# Altium project iMX6 Rex Development Baseboard V1I1.PrjPcb (part 1 of 2)
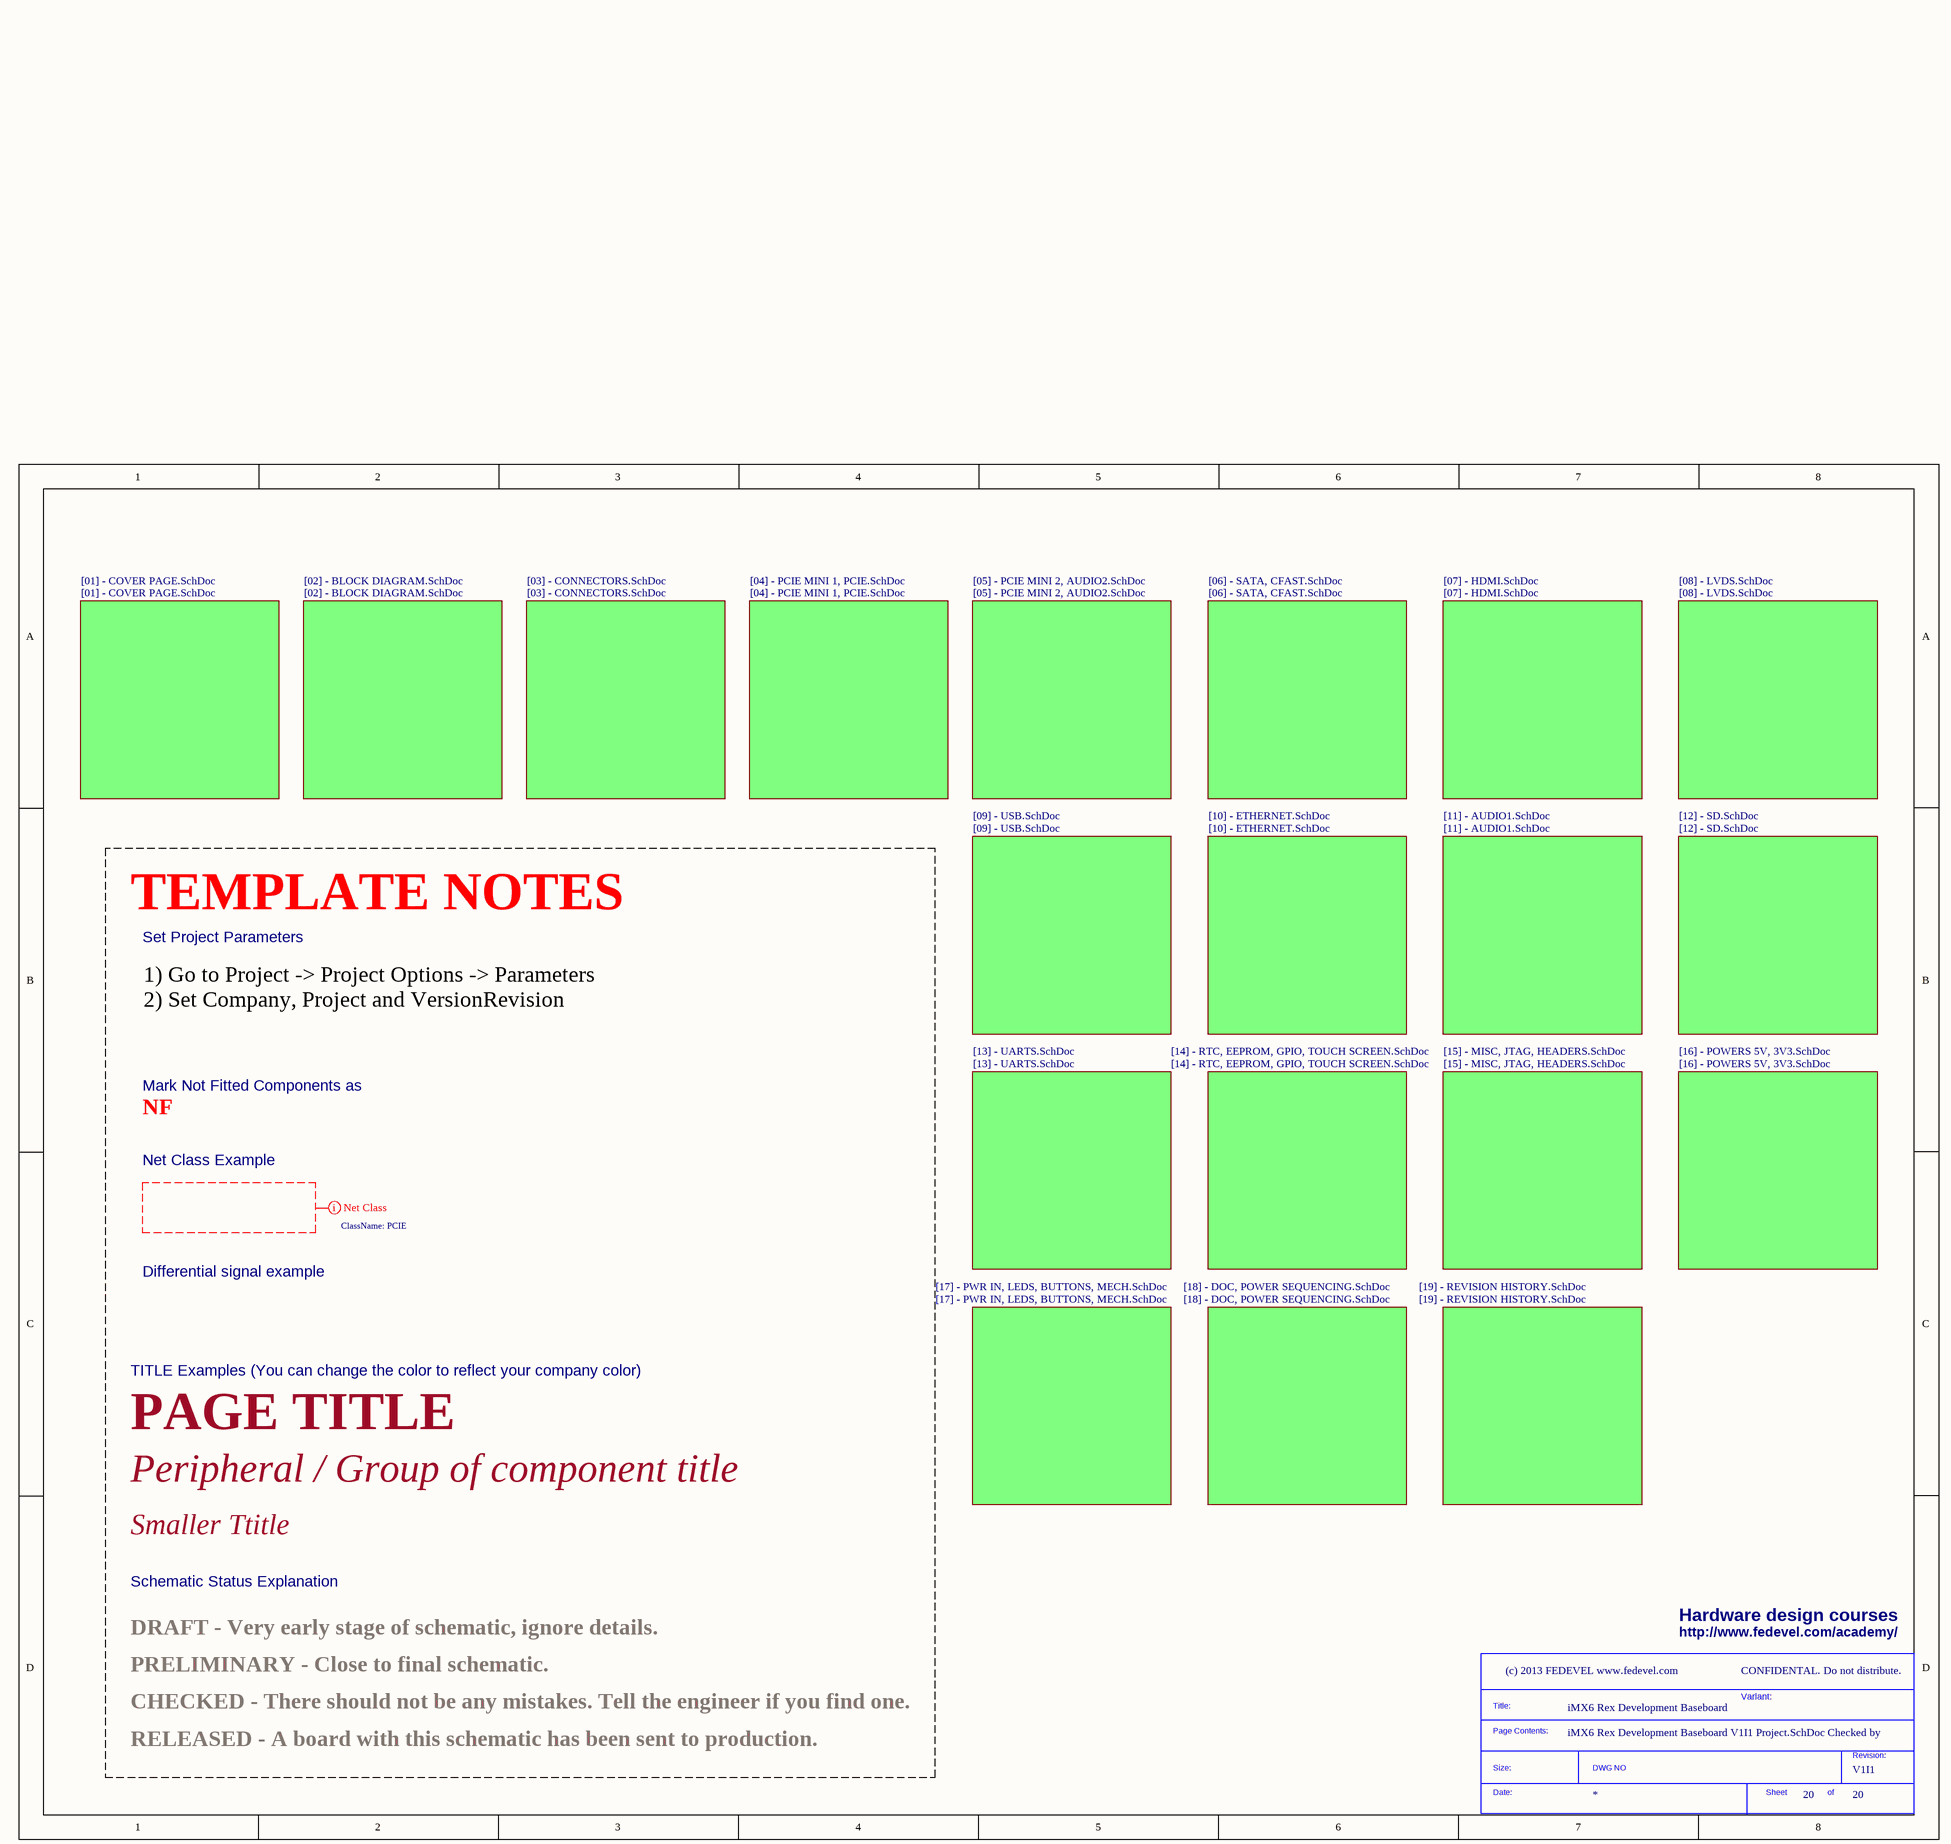
[diagram p0: iMX6 Rex Development Baseboard V1I1 Project.SchDoc]
ClientCompanyName: FEDEVEL Academy; ClientContactEmail: robert.feranec@fedevel.com; ClientContactName: Robert Feranec; ClientWebsite: http://www.fedevel.com/academy/; Company: (c) 2013 FEDEVEL www.fedevel.com; Project: iMX6 Rex Development Baseboard; VersionRevision: V1I1
5 sheets, 70 parts. Net scope: flat (ports and power ports of the same name join across sheets).
Board file: iMX6 Rex Development Baseboard V1I1_PCB.PcbDoc
Sheets:
  iMX6 Rex Development Baseboard V1I1 Project.SchDoc
    [03] - CONNECTORS.SchDoc = [03] - CONNECTORS.SchDoc
    [07] - HDMI.SchDoc = [07] - HDMI.SchDoc
    [15] - MISC, JTAG, HEADERS.SchDoc = [15] - MISC, JTAG, HEADERS.SchDoc
    [18] - DOC, POWER SEQUENCING.SchDoc = [18] - DOC, POWER SEQUENCING.SchDoc

## Sheet iMX6 Rex Development Baseboard V1I1 Project.SchDoc
size A3; CompanyName: FEDEVEL; Organization: FEDEVEL; DocumentNumber: 20; Revision: V1I1; SheetNumber: 20; SheetTotal: 20; PageSetup: Record=PageOptions|CenterHorizontal=True|CenterVertical=True|PrintScale=1.07|XCorrection=1.00|YCorrection=1.00|PrintKind=1|BorderSize=5000000|LeftOffset=0|BottomOffset=0|Orientation=2|PaperLength=1000|PaperWidth=1000|Scale=100|PaperSource=7|PrintQuality=600|MediaType=1|DitherType=10|PaperKind=A3|PrintScaleMode=1; ProjectName: KDS C6A816x Module

### Parts
(Parts that share a designator on the sheet are numbered #1, #2 ... from top to bottom, then left to right.)
*#1  SDTitleBlock  (value not drawn)  (graphical)

### Sub-sheets
[01] - COVER PAGE.SchDoc = [01] - COVER PAGE.SchDoc (file not in this document): no entries
[02] - BLOCK DIAGRAM.SchDoc = [02] - BLOCK DIAGRAM.SchDoc (file not in this document): no entries
[03] - CONNECTORS.SchDoc = [03] - CONNECTORS.SchDoc: no entries
[04] - PCIE MINI 1, PCIE.SchDoc = [04] - PCIE MINI 1, PCIE.SchDoc (file not in this document): no entries
[05] - PCIE MINI 2, AUDIO2.SchDoc = [05] - PCIE MINI 2, AUDIO2.SchDoc (file not in this document): no entries
[06] - SATA, CFAST.SchDoc = [06] - SATA, CFAST.SchDoc (file not in this document): no entries
[07] - HDMI.SchDoc = [07] - HDMI.SchDoc: no entries
[08] - LVDS.SchDoc = [08] - LVDS.SchDoc (file not in this document): no entries
[09] - USB.SchDoc = [09] - USB.SchDoc (file not in this document): no entries
[10] - ETHERNET.SchDoc = [10] - ETHERNET.SchDoc (file not in this document): no entries
[11] - AUDIO1.SchDoc = [11] - AUDIO1.SchDoc (file not in this document): no entries
[12] - SD.SchDoc = [12] - SD.SchDoc (file not in this document): no entries
[13] - UARTS.SchDoc = [13] - UARTS.SchDoc (file not in this document): no entries
[14] - RTC, EEPROM, GPIO, TOUCH SCREEN.SchDoc = [14] - RTC, EEPROM, GPIO, TOUCH SCREEN.SchDoc (file not in this document): no entries
[15] - MISC, JTAG, HEADERS.SchDoc = [15] - MISC, JTAG, HEADERS.SchDoc: no entries
[16] - POWERS 5V, 3V3.SchDoc = [16] - POWERS 5V, 3V3.SchDoc (file not in this document): no entries
[17] - PWR IN, LEDS, BUTTONS, MECH.SchDoc = [17] - PWR IN, LEDS, BUTTONS, MECH.SchDoc (file not in this document): no entries
[18] - DOC, POWER SEQUENCING.SchDoc = [18] - DOC, POWER SEQUENCING.SchDoc: no entries
[19] - REVISION HISTORY.SchDoc = [19] - REVISION HISTORY.SchDoc (file not in this document): no entries

### Layout directives
net class PCIE: (no net found under the mark)

### Notes on the sheet
- TEMPLATE NOTES
- Set Project Parameters
- 1) Go to Project -> Project Options -> Parameters
  2) Set Company, Project and VersionRevision
- NF
- Mark Not Fitted Components as
- Net Class Example
- Differential signal example
- TITLE Examples (You can change the color to reflect your company color)
- PAGE TITLE
- Peripheral / Group of component title
- Smaller Ttitle
- Schematic Status Explanation
- Hardware design courses
- PRELIMINARY - Close to final schematic.
- DRAFT - Very early stage of schematic, ignore details.
- http://www.fedevel.com/academy/
- CONFIDENTAL. Do not distribute.
- CHECKED - There should not be any mistakes. Tell the engineer if you find one.
- Variant:
- Checked by
- RELEASED - A board with this schematic has been sent to production.
- (in symbol SDTitleBlock) Title:; Page Contents:; Revision:; Size:; DWG NO; Date:; Sheet; of

## Sheet [03] - CONNECTORS.SchDoc
size A3; DocumentNumber: 2; SheetNumber: 3; SheetTotal: 19
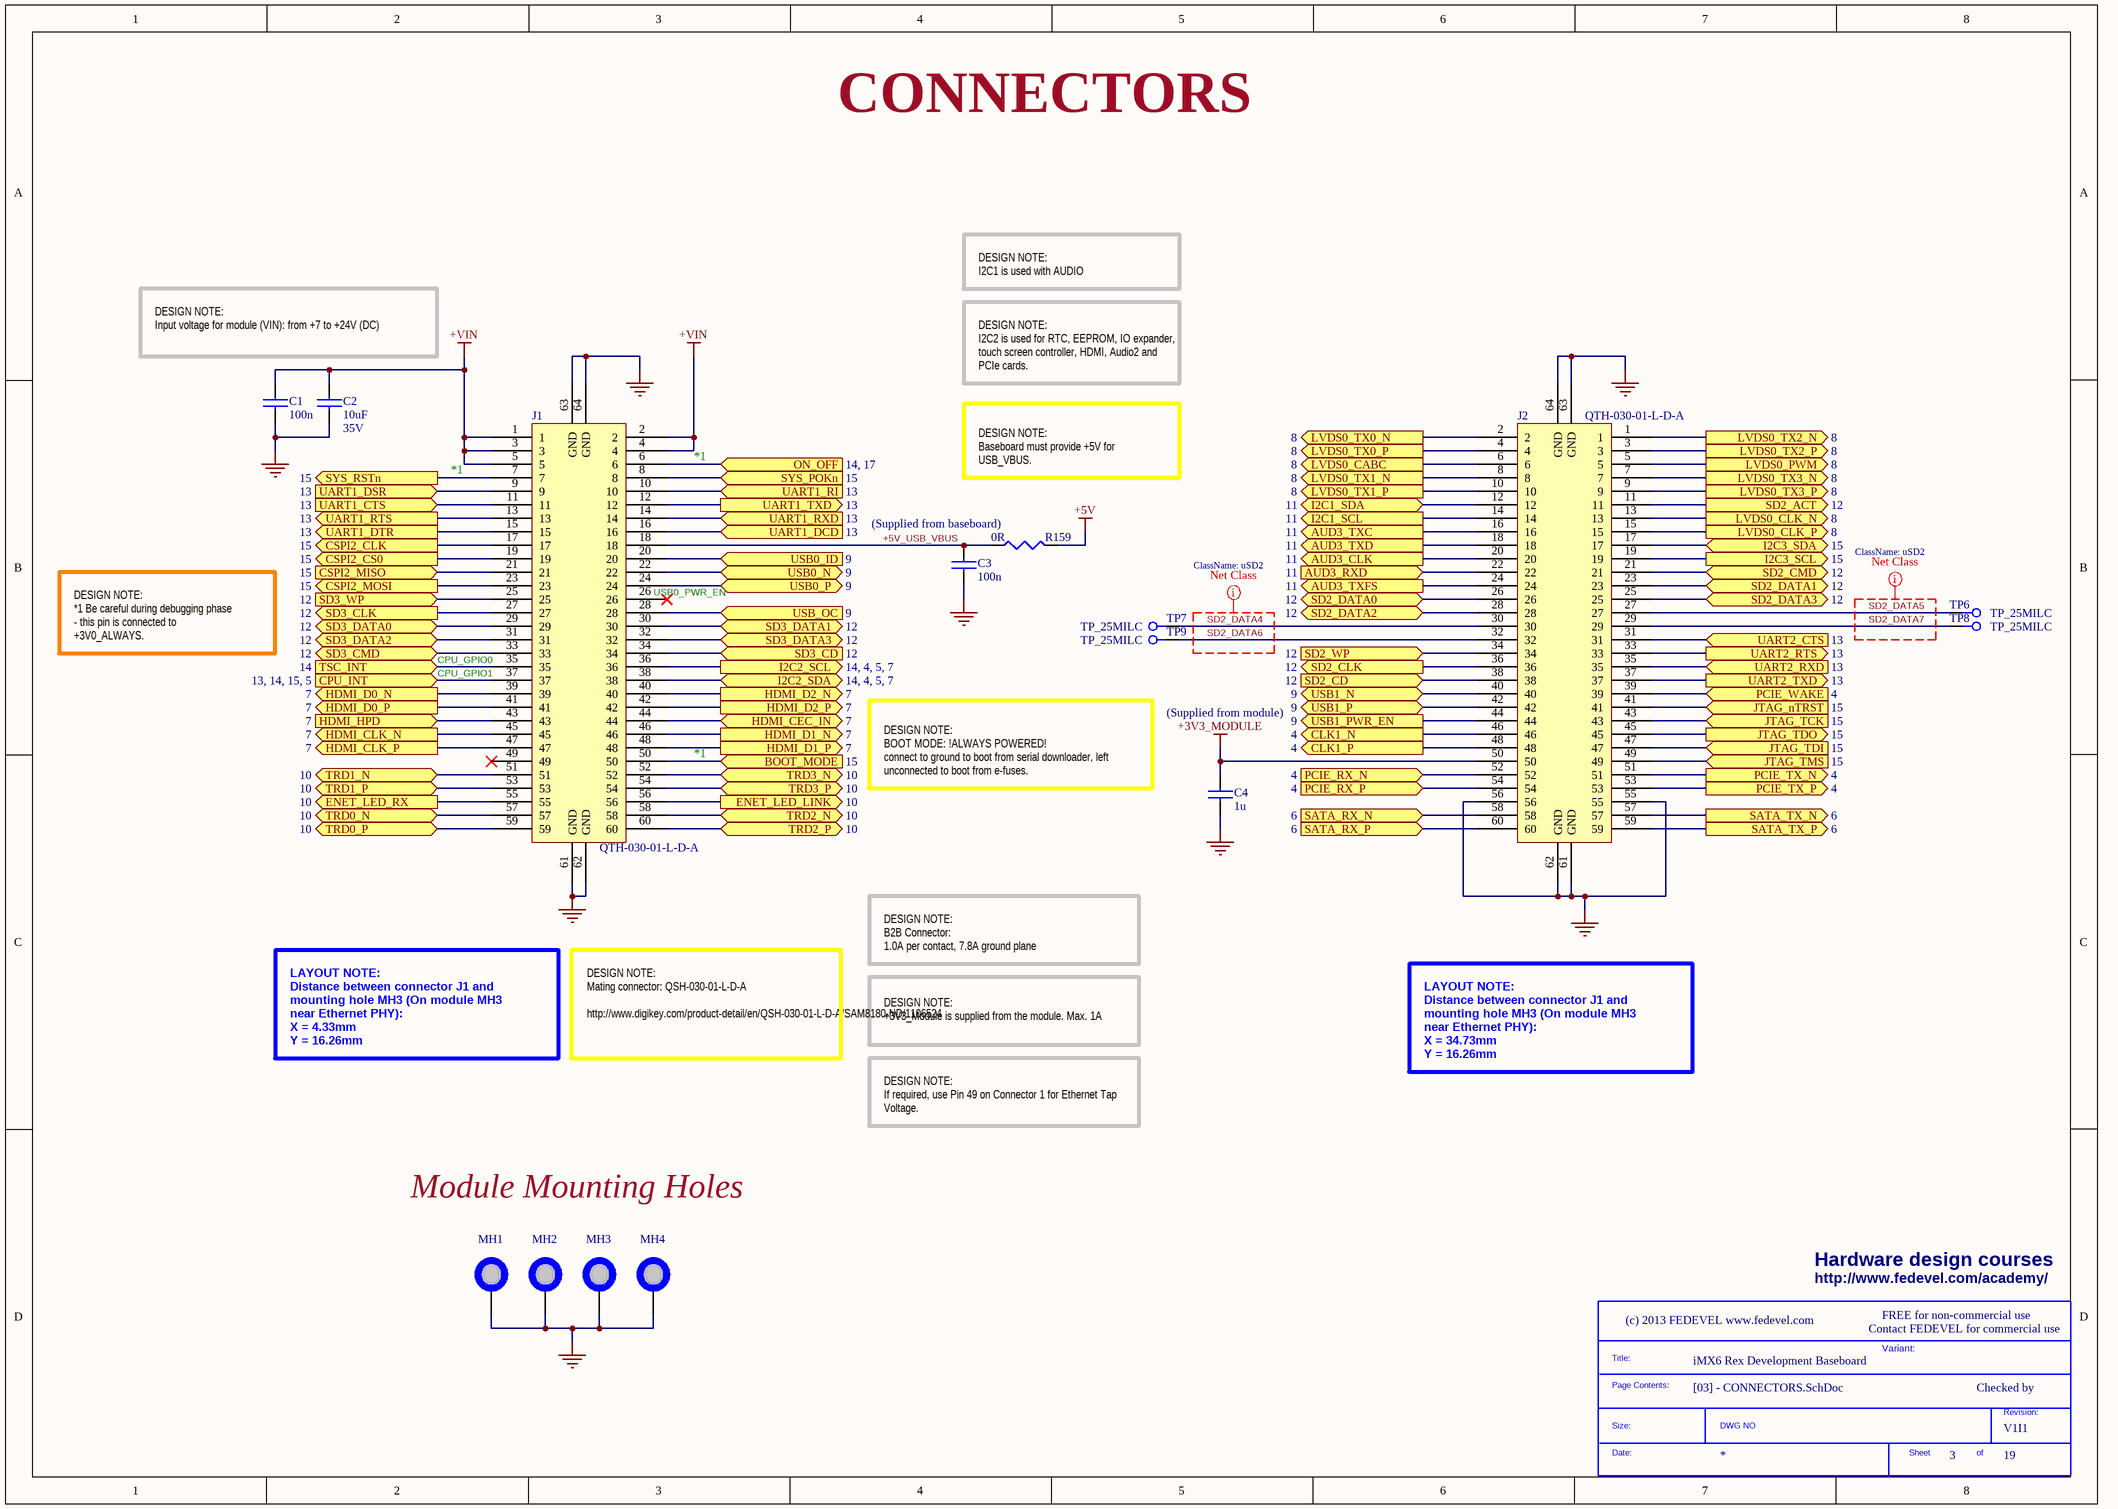
[diagram p1: [03] - CONNECTORS.SchDoc]

### Parts
(Parts that share a designator on the sheet are numbered #1, #2 ... from top to bottom, then left to right.)
*#2  SDTitleBlock  (value not drawn)  (graphical)
C1  100n  [C0402]
C2  10uF  Voltage - Rated: 35V  [C1206]
C3  100n  [C0402]
C4  1u  [C0402]
J1  QTH-030-01-L-D-A  [QTH-030-01-L-D-A]
J2  QTH-030-01-L-D-A  [QTH-030-01-L-D-A]
MH1  MH_5MMC_2.2MMD  [MH_5MMD_2.2MMD]  (value not drawn)  (no BOM)
MH2  MH_5MMC_2.2MMD  [MH_5MMD_2.2MMD]  (value not drawn)  (no BOM)
MH3  MH_5MMC_2.2MMD  [MH_5MMD_2.2MMD]  (value not drawn)  (no BOM)
MH4  MH_5MMC_2.2MMD  [MH_5MMD_2.2MMD]  (value not drawn)  (no BOM)
R159  0R  [R0402]
TP6  TP_25MILC  [TP_25C]  (no BOM)
TP7  TP_25MILC  [TP_25C]  (no BOM)
TP8  TP_25MILC  [TP_25C]  (no BOM)
TP9  TP_25MILC  [TP_25C]  (no BOM)

### Ports
AUD3_CLK (out, see 11), AUD3_RXD (in, see 11), AUD3_TXC (out, see 11), AUD3_TXD (out, see 11), AUD3_TXFS (out, see 11), BOOT_MODE (in, see 15), CLK1_N (out, see 4), CLK1_P (out, see 4), CPU_INT (in, see 13, 14, 15, 5), CSPI2_CLK (out, see 15), CSPI2_CS0 (out, see 15), CSPI2_MISO (in, see 15), CSPI2_MOSI (out, see 15), ENET_LED_LINK (out, see 10), ENET_LED_RX (out, see 10), HDMI_CEC_IN (bidir, see 7), HDMI_CLK_N (out, see 7), HDMI_CLK_P (out, see 7), HDMI_D0_N (out, see 7), HDMI_D0_P (out, see 7), HDMI_D1_N (out, see 7), HDMI_D1_P (out, see 7), HDMI_D2_N (out, see 7), HDMI_D2_P (out, see 7), HDMI_HPD (in, see 7), I2C1_SCL (out, see 11), I2C1_SDA (bidir, see 11), I2C2_SCL (see 14, 4, 5, 7), I2C2_SDA (bidir, see 14, 4, 5, 7), I2C3_SCL (out, see 15), I2C3_SDA (bidir, see 15), JTAG_nTRST (in, see 15), JTAG_TCK (in, see 15), JTAG_TDI (in, see 15), JTAG_TDO (out, see 15), JTAG_TMS (in, see 15), LVDS0_CABC (out, see 8), LVDS0_CLK_N (out, see 8), LVDS0_CLK_P (out, see 8), LVDS0_PWM (out, see 8), LVDS0_TX0_N (out, see 8), LVDS0_TX0_P (out, see 8), LVDS0_TX1_N (out, see 8), LVDS0_TX1_P (out, see 8), LVDS0_TX2_N (out, see 8), LVDS0_TX2_P (out, see 8), LVDS0_TX3_N (out, see 8), LVDS0_TX3_P (out, see 8), ON_OFF (in, see 14, 17), PCIE_RX_N (in, see 4), PCIE_RX_P (in, see 4), PCIE_TX_N (out, see 4), PCIE_TX_P (out, see 4), PCIE_WAKE (in, see 4), SATA_RX_N (in, see 6), SATA_RX_P (in, see 6), SATA_TX_N (out, see 6), SATA_TX_P (out, see 6), SD2_ACT (out, see 12), SD2_CD (in, see 12), SD2_CLK (out, see 12), SD2_CMD (bidir, see 12), SD2_DATA0 (bidir, see 12), SD2_DATA1 (bidir, see 12), SD2_DATA2 (bidir, see 12), SD2_DATA3 (bidir, see 12), SD2_WP (in, see 12), SD3_CD (in, see 12), SD3_CLK (out, see 12), SD3_CMD (bidir, see 12), SD3_DATA0 (bidir, see 12), SD3_DATA1 (bidir, see 12), SD3_DATA2 (bidir, see 12), SD3_DATA3 (bidir, see 12), SD3_WP (in, see 12), SYS_POKn (in, see 15), SYS_RSTn (out, see 15), TRD0_N (bidir, see 10), TRD0_P (bidir, see 10), TRD1_N (bidir, see 10), TRD1_P (bidir, see 10), TRD2_N (bidir, see 10), TRD2_P (bidir, see 10), TRD3_N (bidir, see 10), TRD3_P (bidir, see 10), TSC_INT (in, see 14), UART1_CTS (in, see 13), UART1_DCD (in, see 13), UART1_DSR (in, see 13), UART1_DTR (out, see 13), UART1_RI (in, see 13), UART1_RTS (out, see 13), UART1_RXD (in, see 13), UART1_TXD (out, see 13), UART2_CTS (in, see 13), UART2_RTS (out, see 13), UART2_RXD (in, see 13), UART2_TXD (out, see 13), USB0_ID (in, see 9), USB0_N (bidir, see 9), USB0_P (bidir, see 9), USB1_N (bidir, see 9), USB1_P (bidir, see 9), USB1_PWR_EN (out, see 9), USB_OC (in, see 9)

### Nets
+3V3_MODULE: C4.1 J2.50
+5V: R159.2
+VIN: C1.1 C2.1 J1.1 J1.2 J1.3 J1.4 J1.5
GND: C1.2 C2.2 C3.2 C4.2 J1.61(GND) J1.62(GND) J1.63(GND) J1.64(GND) J2.55 J2.56 J2.61(GND) J2.62(GND) J2.63(GND) J2.64(GND) MH1.1 MH2.1 MH3.1 MH4.1
+5V_USB_VBUS: C3.1 J1.18 R159.1
AUD3_CLK: J2.20 ; port AUD3_CLK
AUD3_RXD: J2.22 ; port AUD3_RXD
AUD3_TXC: J2.16 ; port AUD3_TXC
AUD3_TXD: J2.18 ; port AUD3_TXD
AUD3_TXFS: J2.24 ; port AUD3_TXFS
BOOT_MODE: J1.50 ; port BOOT_MODE
CLK1_N: J2.46 ; port CLK1_N
CLK1_P: J2.48 ; port CLK1_P
CPU_INT: J1.37 ; port CPU_INT
CSPI2_CLK: J1.17 ; port CSPI2_CLK
CSPI2_CS0: J1.19 ; port CSPI2_CS0
CSPI2_MISO: J1.21 ; port CSPI2_MISO
CSPI2_MOSI: J1.23 ; port CSPI2_MOSI
ENET_LED_LINK: J1.56 ; port ENET_LED_LINK
ENET_LED_RX: J1.55 ; port ENET_LED_RX
HDMI_CEC_IN: J1.44 ; port HDMI_CEC_IN
HDMI_CLK_N: J1.45 ; port HDMI_CLK_N
HDMI_CLK_P: J1.47 ; port HDMI_CLK_P
HDMI_D0_N: J1.39 ; port HDMI_D0_N
HDMI_D0_P: J1.41 ; port HDMI_D0_P
HDMI_D1_N: J1.46 ; port HDMI_D1_N
HDMI_D1_P: J1.48 ; port HDMI_D1_P
HDMI_D2_N: J1.40 ; port HDMI_D2_N
HDMI_D2_P: J1.42 ; port HDMI_D2_P
HDMI_HPD: J1.43 ; port HDMI_HPD
I2C1_SCL: J2.14 ; port I2C1_SCL
I2C1_SDA: J2.12 ; port I2C1_SDA
I2C2_SCL: J1.36 ; port I2C2_SCL
I2C2_SDA: J1.38 ; port I2C2_SDA
I2C3_SCL: J2.19 ; port I2C3_SCL
I2C3_SDA: J2.17 ; port I2C3_SDA
JTAG_nTRST: J2.41 ; port JTAG_nTRST
JTAG_TCK: J2.43 ; port JTAG_TCK
JTAG_TDI: J2.47 ; port JTAG_TDI
JTAG_TDO: J2.45 ; port JTAG_TDO
JTAG_TMS: J2.49 ; port JTAG_TMS
LVDS0_CABC: J2.6 ; port LVDS0_CABC
LVDS0_CLK_N: J2.13 ; port LVDS0_CLK_N
LVDS0_CLK_P: J2.15 ; port LVDS0_CLK_P
LVDS0_PWM: J2.5 ; port LVDS0_PWM
LVDS0_TX0_N: J2.2 ; port LVDS0_TX0_N
LVDS0_TX0_P: J2.4 ; port LVDS0_TX0_P
LVDS0_TX1_N: J2.8 ; port LVDS0_TX1_N
LVDS0_TX1_P: J2.10 ; port LVDS0_TX1_P
LVDS0_TX2_N: J2.1 ; port LVDS0_TX2_N
LVDS0_TX2_P: J2.3 ; port LVDS0_TX2_P
LVDS0_TX3_N: J2.7 ; port LVDS0_TX3_N
LVDS0_TX3_P: J2.9 ; port LVDS0_TX3_P
ON_OFF: J1.6 ; port ON_OFF
PCIE_RX_N: J2.52 ; port PCIE_RX_N
PCIE_RX_P: J2.54 ; port PCIE_RX_P
PCIE_TX_N: J2.51 ; port PCIE_TX_N
PCIE_TX_P: J2.53 ; port PCIE_TX_P
PCIE_WAKE: J2.39 ; port PCIE_WAKE
SATA_RX_N: J2.58 ; port SATA_RX_N
SATA_RX_P: J2.60 ; port SATA_RX_P
SATA_TX_N: J2.57 ; port SATA_TX_N
SATA_TX_P: J2.59 ; port SATA_TX_P
SD2_ACT: J2.11 ; port SD2_ACT
SD2_CD: J2.38 ; port SD2_CD
SD2_CLK: J2.36 ; port SD2_CLK
SD2_CMD: J2.21 ; port SD2_CMD
SD2_DATA0: J2.26 ; port SD2_DATA0
SD2_DATA1: J2.23 ; port SD2_DATA1
SD2_DATA2: J2.28 ; port SD2_DATA2
SD2_DATA3: J2.25 ; port SD2_DATA3
SD2_DATA4: J2.30 TP7.1
SD2_DATA5: J2.27 TP6.1
SD2_DATA6: J2.32 TP9.1
SD2_DATA7: J2.29 TP8.1
SD2_WP: J2.34 ; port SD2_WP
SD3_CD: J1.34 ; port SD3_CD
SD3_CLK: J1.27 ; port SD3_CLK
SD3_CMD: J1.33 ; port SD3_CMD
SD3_DATA0: J1.29 ; port SD3_DATA0
SD3_DATA1: J1.30 ; port SD3_DATA1
SD3_DATA2: J1.31 ; port SD3_DATA2
SD3_DATA3: J1.32 ; port SD3_DATA3
SD3_WP: J1.25 ; port SD3_WP
SYS_POKn: J1.8 ; port SYS_POKn
SYS_RSTn: J1.7 ; port SYS_RSTn
TRD0_N: J1.57 ; port TRD0_N
TRD0_P: J1.59 ; port TRD0_P
TRD1_N: J1.51 ; port TRD1_N
TRD1_P: J1.53 ; port TRD1_P
TRD2_N: J1.58 ; port TRD2_N
TRD2_P: J1.60 ; port TRD2_P
TRD3_N: J1.52 ; port TRD3_N
TRD3_P: J1.54 ; port TRD3_P
TSC_INT: J1.35 ; port TSC_INT
UART1_CTS: J1.11 ; port UART1_CTS
UART1_DCD: J1.16 ; port UART1_DCD
UART1_DSR: J1.9 ; port UART1_DSR
UART1_DTR: J1.15 ; port UART1_DTR
UART1_RI: J1.10 ; port UART1_RI
UART1_RTS: J1.13 ; port UART1_RTS
UART1_RXD: J1.14 ; port UART1_RXD
UART1_TXD: J1.12 ; port UART1_TXD
UART2_CTS: J2.31 ; port UART2_CTS
UART2_RTS: J2.33 ; port UART2_RTS
UART2_RXD: J2.35 ; port UART2_RXD
UART2_TXD: J2.37 ; port UART2_TXD
USB0_ID: J1.20 ; port USB0_ID
USB0_N: J1.22 ; port USB0_N
USB0_P: J1.24 ; port USB0_P
USB1_N: J2.40 ; port USB1_N
USB1_P: J2.42 ; port USB1_P
USB1_PWR_EN: J2.44 ; port USB1_PWR_EN
USB_OC: J1.28 ; port USB_OC

Not connected (* = marked no-connect by the designer): J1 26* 49* 65(HOLE1) 66(HOLE2); J2 65(HOLE1) 66(HOLE2)

### Layout directives
net class uSD2: SD2_DATA4, SD2_DATA5, SD2_DATA6, SD2_DATA7

### Notes on the sheet
- CONNECTORS
- DESIGN NOTE:
  I2C1 is used with AUDIO
- DESIGN NOTE:
  Input voltage for module (VIN): from +7 to +24V (DC)
- DESIGN NOTE:
  I2C2 is used for RTC, EEPROM, IO expander, touch screen controller, HDMI, Audio2 and PCIe cards.
- *1
- DESIGN NOTE:
  Baseboard must provide +5V for USB_VBUS.
- (near R159) (Supplied from baseboard)
- DESIGN NOTE:
  *1 Be careful during debugging phase - this pin is connected to +3V0_ALWAYS.
- (near J1) USB0_PWR_EN
- (near J1) CPU_GPIO0
- (near J1) CPU_GPIO1
- (Supplied from module)
- DESIGN NOTE:
  BOOT MODE: !ALWAYS POWERED!
  connect to ground to boot from serial downloader, left unconnected to boot from e-fuses.
- DESIGN NOTE:
  B2B Connector:
  1.0A per contact, 7.8A ground plane
- LAYOUT NOTE:
  Distance between connector J1 and mounting hole MH3 (On module MH3 near Ethernet PHY):
  X = 4.33mm
  Y = 16.26mm
- DESIGN NOTE:
  Mating connector: QSH-030-01-L-D-A
  http://www.digikey.com/product-detail/en/QSH-030-01-L-D-A/SAM8180-ND/1106524
- DESIGN NOTE:
  +3V3_Module is supplied from the module. Max. 1A
- LAYOUT NOTE:
  Distance between connector J1 and mounting hole MH3 (On module MH3 near Ethernet PHY):
  X = 34.73mm
  Y = 16.26mm
- DESIGN NOTE:
  If required, use Pin 49 on Connector 1 for Ethernet Tap Voltage.
- Module Mounting Holes
- Hardware design courses
- http://www.fedevel.com/academy/
- Contact FEDEVEL for commercial use
- FREE for non-commercial use
- Variant:
- Checked by
- (in symbol SDTitleBlock) Title:; Page Contents:; Revision:; Size:; DWG NO; Date:; Sheet; of

### Library data of the parts
C1 C3 = C1005X5R1H104K: CAP CER .10UF 50V X5R 10% 0402; Manufacturer: TDK Corporation; Capacitance: 0.1µF; Value: 100nF; .Checked PCB: used; Description: CAP CER 0.1UF 50V 10% X5R 0402; Category: Capacitors; Supplier Part Number: 445-5942-1-ND; Manufacturer Part Number: C1005X5R1H104K; Operating Temperature: -55°C ~ 85°C; Package / Case: 0402 (1005 Metric); Price 1k [$]: 0.02340; .Checked SCH: used; Voltage - Rated: 50V; Supplier: Digikey; Supplier 1: Digi-Key; Supplier Part Number 1: 445-5942-1-ND; RoHS: RoHS Compliant; Stock 1: 106926; Pricing 1: 1=0.27, 10=0.18, 100=0.072, 250=0.05176, 500=0.0369, 1000=0.027 (USD); Tolerance: ±10%; Temperature Coefficient: X5R; Mounting Type: Surface Mount, MLCC; Applications: General Purpose; Ratings: -; Size / Dimension: 0.039" L x 0.020" W (1.00mm x 0.50mm); Height - Seated (Max): -; Thickness (Max): 0.022" (0.55mm); Lead Spacing: -; Features: -; Packaging: Cut Tape (CT); Lead Style: -; ComponentLink1URL: http://www.tdk.co.jp/tefe02/e412_c.pdf; ComponentLink1Description: http://www.tdk.co.jp/tefe02/e412_c.pdf
C2 = GRM31CR6YA106KA12L: CAP CER 10UF 35V X5R 1206; Manufacturer: Murata Electronics North America; Capacitance: 10µF; .Checked PCB: used; Description: CAP CER 10UF 35V 10% X5R 1206; Tolerance: ±10%; Category: Capacitors; Manufacturer Part Number: GRM31CR6YA106KA12L; Operating Temperature: -55°C ~ 85°C; Package / Case: 1206 (3216 Metric); Price 1k [$]: 0.19448; Value: 10uF; .Checked SCH: used; Supplier Part Number: 490-5524-1-ND; Supplier: Digikey; Supplier 1: Digi-Key; Supplier Part Number 1: 490-5524-1-ND; RoHS: RoHS Compliant; Stock 1: 76334; Pricing 1: 1=0.6, 10=0.501, 50=0.359, 100=0.3142, 250=0.24684, 500=0.2244, 1000=0.17952 (USD); Temperature Coefficient: X5R; Mounting Type: Surface Mount, MLCC; Applications: General Purpose; Ratings: -; Size / Dimension: 0.126" L x 0.063" W (3.20mm x 1.60mm); Height - Seated (Max): -; Thickness (Max): 0.071" (1.80mm); Lead Spacing: -; Features: -; Packaging: Cut Tape (CT); Lead Style: -; ComponentLink1URL: http://www.murata.com/products/catalog/pdf/c02e.pdf; ComponentLink1Description: http://www.murata.com/products/catalog/pdf/c02e.pdf
C4 = C1005X5R1C105K: CAP CER 1.0UF 16V X5R 0402; Manufacturer: TDK Corporation; Capacitance: 1.0µF; Value: 1uF; .Checked PCB: used; Description: CAP CER 1UF 16V 10% X5R 0402; Tolerance: ±10%; Category: Capacitors; Manufacturer Part Number: C1005X5R1C105K; Operating Temperature: -55°C ~ 85°C; Package / Case: 0402 (1005 Metric); Price 1k [$]: 0.02080; .Checked SCH: used; Voltage - Rated: 16V; Supplier Part Number: 445-4978-1-ND; Supplier: Digikey; Supplier 1: Digi-Key; Supplier Part Number 1: 445-4978-1-ND; RoHS: RoHS Compliant; Stock 1: 341010; Pricing 1: 1=0.24, 10=0.16, 100=0.064, 250=0.046, 500=0.0328, 1000=0.024 (USD); Temperature Coefficient: X5R; Mounting Type: Surface Mount, MLCC; Applications: General Purpose; Ratings: -; Size / Dimension: 0.039" L x 0.020" W (1.00mm x 0.50mm); Height - Seated (Max): -; Thickness (Max): 0.022" (0.55mm); Lead Spacing: -; Features: -; Packaging: Cut Tape (CT); Lead Style: -; ComponentLink1URL: http://www.tdk.co.jp/tefe02/e412_c.pdf; ComponentLink1Description: http://www.tdk.co.jp/tefe02/e412_c.pdf
J1 J2 = QTH-030-01-L-D-A: CONN HEADER HS .5MM 60POS DL AU; Manufacturer: Samtec Inc; .Checked PCB: used; Connector Type: Header, Outer Shroud Contacts; Number of Positions: 60; Pitch: 0.020" (0.50mm); Mating connector: QSH-030-01-L-D-A; Mated Stacking Heights: 5mm; .Checked SCH: used; Category: Connectors, Interconnects; Supplier Part Number: SAM8185-ND; Manufacturer Part Number: QTH-030-01-L-D-A; Price 1k [$]: 5.65775; Value: QTH-030-01-L-D-A; Number of Rows: 2; Height with mainting: 5mm; Supplier: Digikey; Supplier 1: Digi-Key; Supplier Part Number 1: SAM8185-ND; RoHS: RoHS Compliant; Stock 1: 4926; Pricing 1: 1=9.14, 10=8.455, 25=7.9976, 50=7.5862, 100=7.0835, 250=6.16952, 500=5.941, 1000=5.7125, 2500=5.484 (USD); Mounting Type: Surface Mount; Features: Board Guide, Ground Bus (Plane); Contact Finish: Gold; Contact Finish Thickness: 10µin (0.25µm); Packaging: Tray; Height Above Board: 0.168" (4.27mm); ComponentLink1URL: http://www.samtec.com/ftppub/cpdf/QTH-XXX-XX-X-D-XXX-MKT.pdf; ComponentLink1Description: http://www.samtec.com/ftppub/cpdf/QTH-XXX-XX-X-D-XXX-MKT.pdf
MH1-MH4 = MH_5MMC_2.2MMD: Mounting Hole 5mm Diameter, 2.2mm Drill
R159 = RC0402JR-070RL: RES 0.0 OHM 1/16W 0402 SMD; Manufacturer: Yageo; Resistance (Ohms): 0.0; Power (Watts): 0.063W, 1/16W; Tolerance: Jumper; .Checked PCB: used; Category: Resistors; Supplier Part Number: 311-0.0JRCT-ND; Manufacturer Part Number: RC0402JR-070RL; Package / Case: 0402 (1005 Metric); Price 1k [$]: 0.01389; Value: 0R; .Checked SCH: used; Supplier: Digikey; Supplier 1: Digi-Key; Supplier Part Number 1: 311-0.0JRCT-ND; RoHS: RoHS Compliant; Stock 1: 1106330; Pricing 1: 10=0.012, 50=0.009, 100=0.0069, 250=0.00512, 500=0.0038, 1000=0.00253 (USD); Composition: Thick Film; Features: -; Temperature Coefficient: -; Size / Dimension: 0.039" L x 0.020" W (1.00mm x 0.50mm); Height: 0.016" (0.40mm); Number of Terminations: 2; Packaging: Cut Tape (CT); ComponentLink1URL: http://www.yageo.com/documents/recent/PYu-RC0402_51_RoHS_L_6.pdf; ComponentLink1Description: http://www.yageo.com/documents/recent/PYu-RC0402_51_RoHS_L_6.pdf
TP6-TP9 = TP_25MILC: Test Point 25mil

## Sheet [07] - HDMI.SchDoc
size A3; DocumentNumber: 2; SheetNumber: 7; SheetTotal: 20
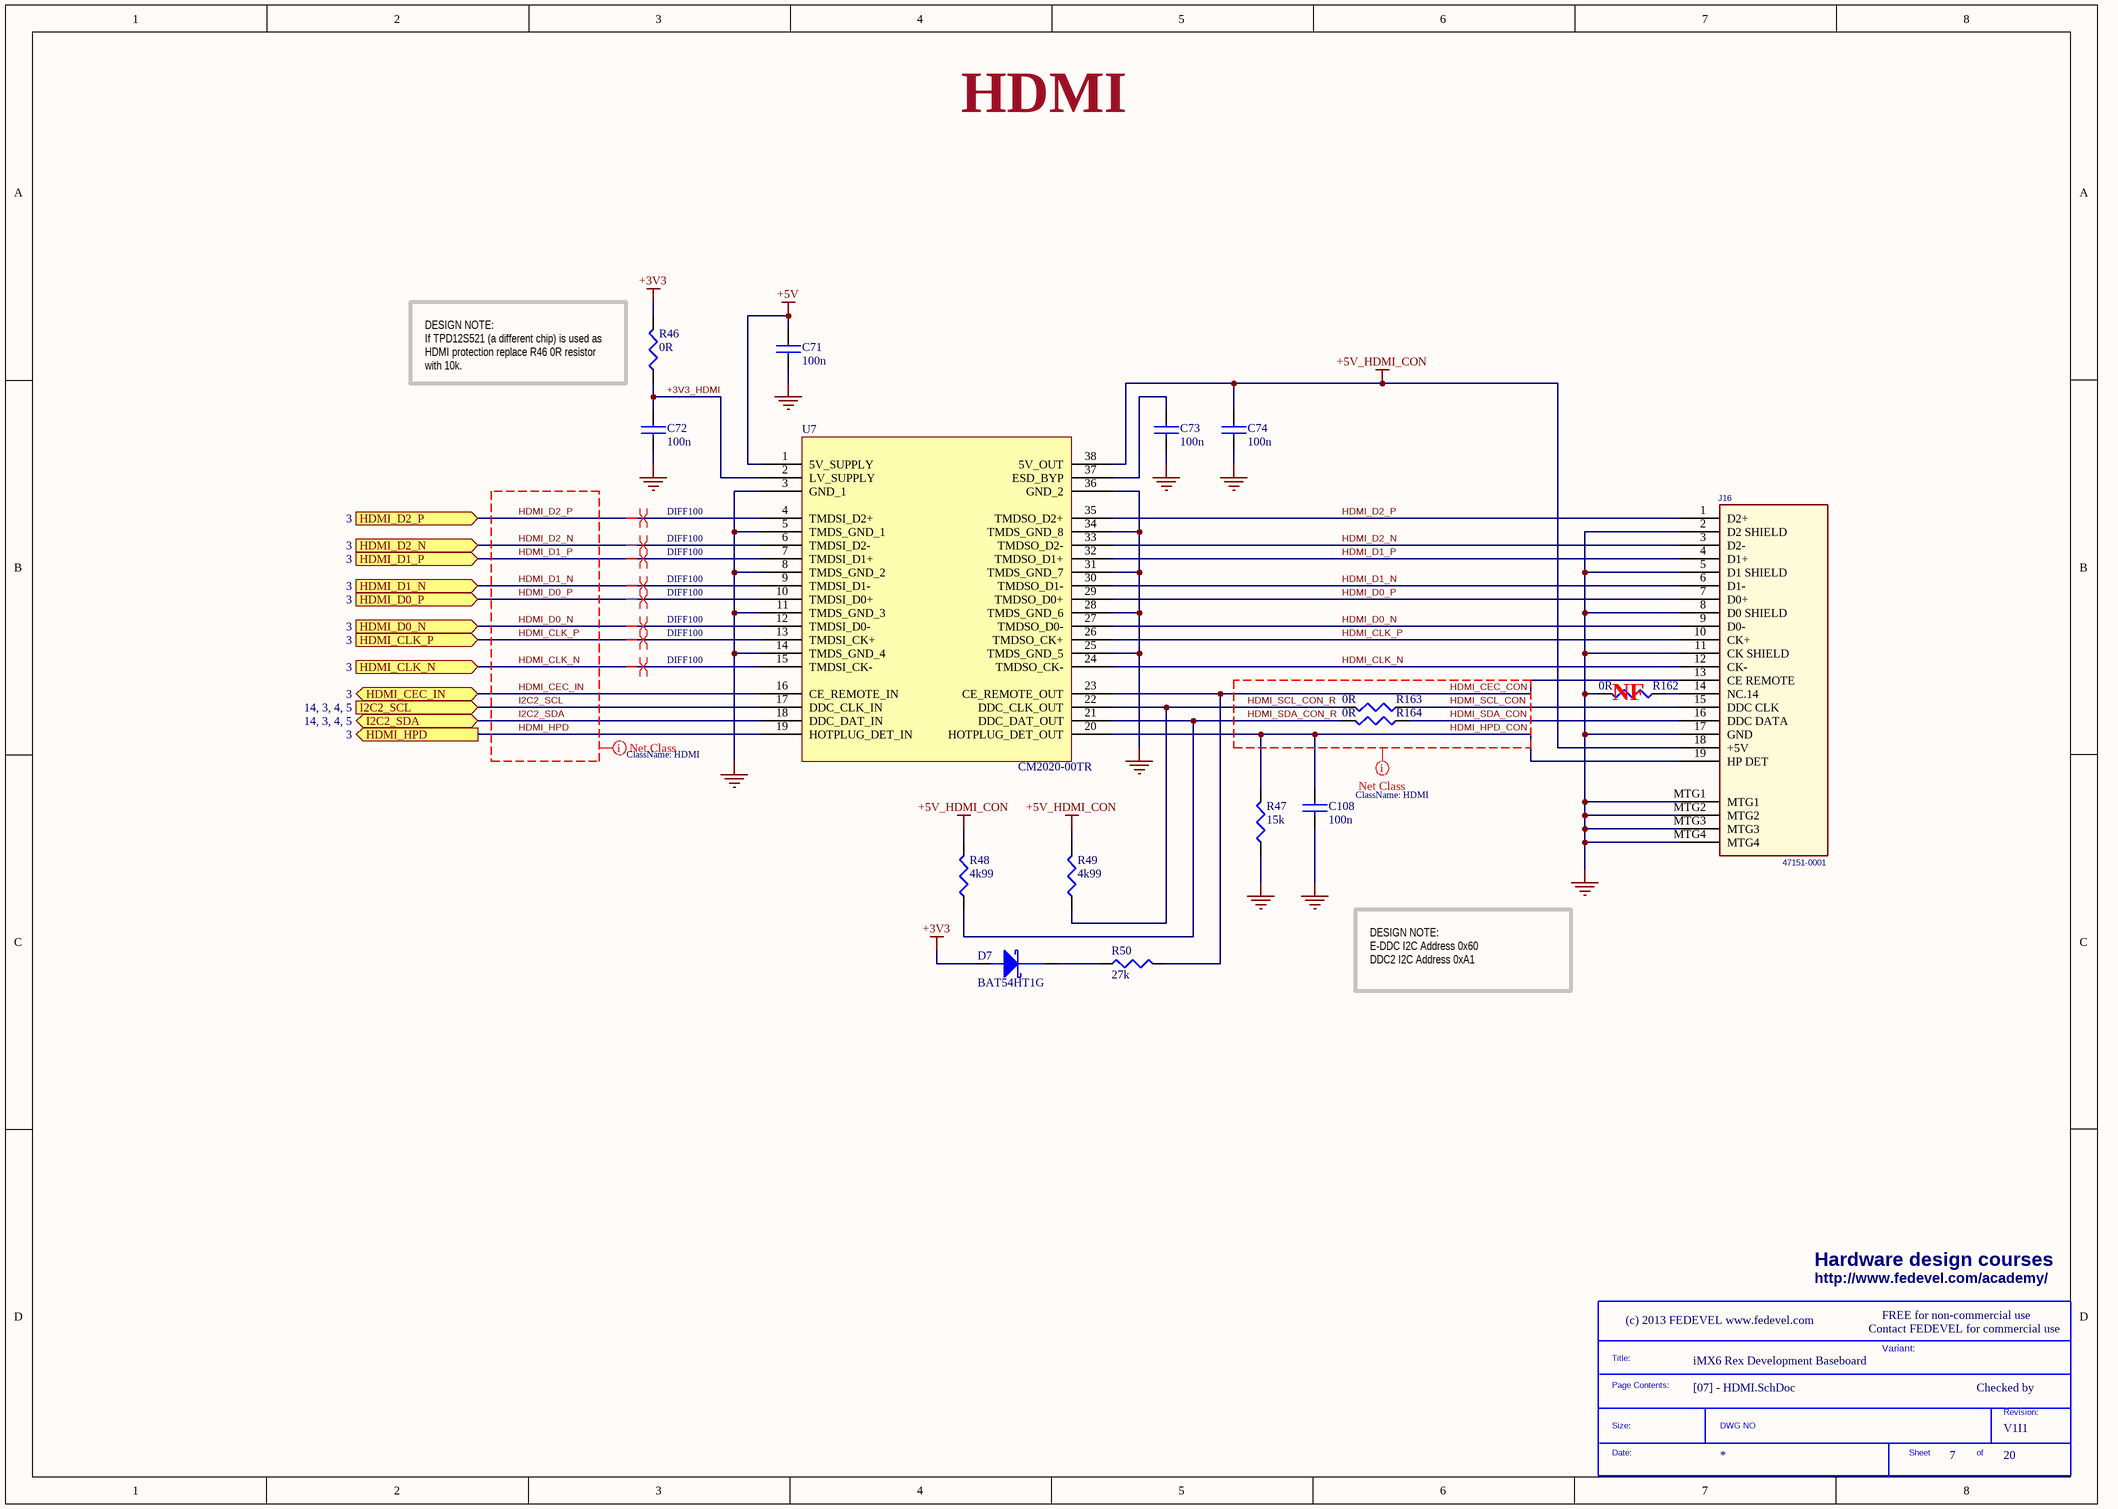
[diagram p2: [07] - HDMI.SchDoc]

### Parts
(Parts that share a designator on the sheet are numbered #1, #2 ... from top to bottom, then left to right.)
*#3  SDTitleBlock  (value not drawn)  (graphical)
C71  100n  [C0402]
C72  100n  [C0402]
C73  100n  [C0402]
C74  100n  [C0402]
C108  100n  [C0402]
D7  BAT54HT1G  [SOD323]
J16  47151-0001  [HDMI]
R46  0R  [R0402]
R47  15k  [R0402]
R48  4k99  [R0402]
R49  4k99  [R0402]
R50  27k  [R0402]
R162  0R  [R0402]
R163  0R  [R0402]
R164  0R  [R0402]
U7  CM2020-00TR  [TSSOP_38]

### Ports
HDMI_CEC_IN (bidir, see 3), HDMI_CLK_N (in, see 3), HDMI_CLK_P (in, see 3), HDMI_D0_N (in, see 3), HDMI_D0_P (in, see 3), HDMI_D1_N (in, see 3), HDMI_D1_P (in, see 3), HDMI_D2_N (in, see 3), HDMI_D2_P (in, see 3), HDMI_HPD (out, see 3), I2C2_SCL (see 14, 3, 4, 5), I2C2_SDA (bidir, see 14, 3, 4, 5)

### Nets
+3V3: D7.2(Anode) R46.2
+5V: C71.1 U7.1(5V_SUPPLY)
+5V_HDMI_CON: C74.1 J16.18(+5V) R48.2 R49.2 U7.38(5V_OUT)
GND: C71.2 C72.2 C73.2 C74.2 C108.2 J16.2(D2_SHIELD) J16.5(D1_SHIELD) J16.8(D0_SHIELD) J16.11(CK_SHIELD) J16.17(GND) J16.MTG1 J16.MTG2 J16.MTG3 J16.MTG4 R47.1 R162.2 U7.3(GND_1) U7.5(TMDS_GND_1) U7.8(TMDS_GND_2) U7.11(TMDS_GND_3) U7.14(TMDS_GND_4) U7.25(TMDS_GND_5) U7.28(TMDS_GND_6) U7.31(TMDS_GND_7) U7.34(TMDS_GND_8) U7.36(GND_2)
+3V3_HDMI: C72.1 R46.1 U7.2(LV_SUPPLY)
HDMI_CEC_CON: J16.13(CE_REMOTE) R50.2 U7.23(CE_REMOTE_OUT)
HDMI_CEC_IN: U7.16(CE_REMOTE_IN) ; port HDMI_CEC_IN
HDMI_CLK_N: J16.12(CK-) U7.15(TMDSI_CK-) U7.24(TMDSO_CK-) ; port HDMI_CLK_N
HDMI_CLK_P: J16.10(CK+) U7.13(TMDSI_CK+) U7.26(TMDSO_CK+) ; port HDMI_CLK_P
HDMI_D0_N: J16.9(D0-) U7.12(TMDSI_D0-) U7.27(TMDSO_D0-) ; port HDMI_D0_N
HDMI_D0_P: J16.7(D0+) U7.10(TMDSI_D0+) U7.29(TMDSO_D0+) ; port HDMI_D0_P
HDMI_D1_N: J16.6(D1-) U7.9(TMDSI_D1-) U7.30(TMDSO_D1-) ; port HDMI_D1_N
HDMI_D1_P: J16.4(D1+) U7.7(TMDSI_D1+) U7.32(TMDSO_D1+) ; port HDMI_D1_P
HDMI_D2_N: J16.3(D2-) U7.6(TMDSI_D2-) U7.33(TMDSO_D2-) ; port HDMI_D2_N
HDMI_D2_P: J16.1(D2+) U7.4(TMDSI_D2+) U7.35(TMDSO_D2+) ; port HDMI_D2_P
HDMI_HPD: U7.19(HOTPLUG_DET_IN) ; port HDMI_HPD
HDMI_HPD_CON: C108.1 J16.19(HP_DET) R47.2 U7.20(HOTPLUG_DET_OUT)
HDMI_SCL_CON: J16.15(DDC_CLK) R163.1
HDMI_SCL_CON_R: R49.1 R163.2 U7.22(DDC_CLK_OUT)
HDMI_SDA_CON: J16.16(DDC_DATA) R164.1
HDMI_SDA_CON_R: R48.1 R164.2 U7.21(DDC_DAT_OUT)
I2C2_SCL: U7.17(DDC_CLK_IN) ; port I2C2_SCL
I2C2_SDA: U7.18(DDC_DAT_IN) ; port I2C2_SDA
NetC73_1: C73.1 U7.37(ESD_BYP)
NetD7_1: D7.1(Cathode) R50.1
NetJ16_14: J16.14(NC.14) R162.1

### Layout directives
net class HDMI: HDMI_CEC_CON, HDMI_CEC_IN, HDMI_CLK_N, HDMI_CLK_P, HDMI_D0_N, HDMI_D0_P, HDMI_D1_N, HDMI_D1_P, HDMI_D2_N, HDMI_D2_P, HDMI_HPD, HDMI_HPD_CON, HDMI_SCL_CON, HDMI_SCL_CON_R, HDMI_SDA_CON, HDMI_SDA_CON_R, I2C2_SCL, I2C2_SDA
differential pair; net class DIFF100: HDMI_CLK_N, HDMI_CLK_P, HDMI_D0_N, HDMI_D0_P, HDMI_D1_N, HDMI_D1_P, HDMI_D2_N, HDMI_D2_P

### Notes on the sheet
- HDMI
- DESIGN NOTE:
  If TPD12S521 (a different chip) is used as HDMI protection replace R46 0R resistor with 10k.
- (near R162) NF
- DESIGN NOTE:
  E-DDC I2C Address 0x60
  DDC2 I2C Address 0xA1
- Hardware design courses
- http://www.fedevel.com/academy/
- Contact FEDEVEL for commercial use
- FREE for non-commercial use
- Variant:
- Checked by
- (in symbol SDTitleBlock) Title:; Page Contents:; Revision:; Size:; DWG NO; Date:; Sheet; of

### Library data of the parts
C71-C74 C108 = C1005X5R1H104K: as C1 on sheet [03] - CONNECTORS; Category: Capacitors; Supplier Part Number: 445-5942-1-ND; Manufacturer Part Number: C1005X5R1H104K; Operating Temperature: -55°C ~ 85°C; Package / Case: 0402 (1005 Metric); Price 1k [$]: 0.02340; .Checked SCH: used; Voltage - Rated: 50V; Supplier: Digikey; Supplier 1: Digi-Key; Supplier Part Number 1: 445-5942-1-ND; RoHS: RoHS Compliant; Stock 1: 106926; Pricing 1: 1=0.27, 10=0.18, 100=0.072, 250=0.05176, 500=0.0369, 1000=0.027 (USD); Tolerance: ±10%; Temperature Coefficient: X5R; Mounting Type: Surface Mount, MLCC; Applications: General Purpose; Ratings: -; Size / Dimension: 0.039" L x 0.020" W (1.00mm x 0.50mm); Height - Seated (Max): -; Thickness (Max): 0.022" (0.55mm); Lead Spacing: -; Features: -; Packaging: Cut Tape (CT); Lead Style: -; ComponentLink1URL: http://www.tdk.co.jp/tefe02/e412_c.pdf; ComponentLink1Description: http://www.tdk.co.jp/tefe02/e412_c.pdf
D7 = BAT54HT1G: DIODE SCHOTTKY 30V 0.2A SOD323; Manufacturer: Fairchild Semiconductor; Current - Average Rectified (Io): 200mA; Voltage - Forward (Vf) (Max) @ If: 800mV @ 100mA; Speed: Small Signal =< 200mA (Io), Any Speed; Reverse Recovery Time (trr): 5ns; Current - Reverse Leakage @ Vr: 2µA @ 25V; Capacitance @ Vr, F: 10pF @ 1V, 1MHz; Thermal Resistance: 600°C/W Ja; .Creator: MM; .Checked PCB: RF, used by MM; Supplier 1: Digi-Key; Manufacturer Part Number: BAT54HT1G; RoHS: RoHS Compliant; Category: Discrete Semiconductor Products; Stock 1: 11388; Pricing 1: 1=0.3, 10=0.276, 25=0.1984, 100=0.1543, 250=0.09696, 500=0.0826, 1000=0.05628 (USD); Packaging: Cut Tape (CT); Diode Type: Schottky; Voltage - DC Reverse (Vr) (Max): 30V; Mounting Type: Surface Mount; Package / Case: SC-76, SOD-323; Supplier Device Package: SOD-323; Operating Temperature - Junction: -55°C ~ 150°C; ComponentLink1URL: http://www.fairchildsemi.com/ds/BA/BAT54HT1G.pdf; ComponentLink1Description: http://www.fairchildsemi.com/ds/BA/BAT54HT1G.pdf; Supplier Part Number 1: BAT54HT1GCT-ND; .Checked SCH: MM
J16 = 47151-0001: CONN RCPT 19POS HDMI RT ANG SMD; Manufacturer: Molex Connector Corporation; .Checked PCB: used; Number of Positions: 19; Pitch: 0.50mm (.020"); Gender: Receptacle; .Checked SCH: used; Category: Connectors, Interconnects; Connector Type: HDMI; Family: USB, IEEE-1394 (Firewire), DVI, HDMI; Manufacturer Part Number: 47151-0001; Operating Temperature: -20°C to +85°C; Price 1k [$]: 1.74610; Supplier: Digikey; Supplier Part Number: WM19086CT-ND; Value: 47151-0001; Supplier 1: Digi-Key; Supplier Part Number 1: WM19086CT-ND; RoHS: RoHS Compliant; Stock 1: 2756; Pricing 1: 1=3.1, 10=2.57, 50=2.1456, 100=1.9034 (USD); Number of Contacts: 19; Specifications: -; Mounting Type: Surface Mount, Right Angle, Horizontal; Features: Detent Lock; Packaging: Cut Tape (CT); Ingress Protection: -; ComponentLink1URL: http://www.molex.com/pdm_docs/sd/471510001_sd.pdf; ComponentLink1Description: http://www.molex.com/pdm_docs/sd/471510001_sd.pdf
R46 R162-R164 = RC0402JR-070RL: as R159 on sheet [03] - CONNECTORS; Category: Resistors; Manufacturer Part Number: RC0402JR-070RL; Package / Case: 0402 (1005 Metric); Price 1k [$]: 0.01389; Value: 0R; .Checked SCH: used; Supplier Part Number: 311-0.0JRCT-ND; Supplier: Digikey; Supplier 1: Digi-Key; Supplier Part Number 1: 311-0.0JRCT-ND; RoHS: RoHS Compliant; Stock 1: 1106330; Pricing 1: 10=0.012, 50=0.009, 100=0.0069, 250=0.00512, 500=0.0038, 1000=0.00253 (USD); Composition: Thick Film; Features: -; Temperature Coefficient: -; Size / Dimension: 0.039" L x 0.020" W (1.00mm x 0.50mm); Height: 0.016" (0.40mm); Number of Terminations: 2; Packaging: Cut Tape (CT); ComponentLink1URL: http://www.yageo.com/documents/recent/PYu-RC0402_51_RoHS_L_6.pdf; ComponentLink1Description: http://www.yageo.com/documents/recent/PYu-RC0402_51_RoHS_L_6.pdf
R47 = RC0402FR-0715KL: RES 15.0K OHM 1/16W 1% 0402 SMD; Manufacturer: Yageo; Power (Watts): 0.063W, 1/16W; .Checked PCB: used; Temperature Coefficient: ±100ppm/°C; Category: Resistors; Supplier Part Number: 311-15.0KLRCT-ND; Manufacturer Part Number: RC0402FR-0715KL; Package / Case: 0402 (1005 Metric); Price 1k [$]: 0.01421; Resistance (Ohms): 15K; Tolerance: ±1%; Value: 15k; .Checked SCH: used; Supplier: Digikey; Supplier 1: Digi-Key; Supplier Part Number 1: 311-15.0KLRCT-ND; RoHS: RoHS Compliant; Stock 1: 31992; Pricing 1: 10=0.014, 50=0.0104, 100=0.0079, 250=0.00584, 500=0.00432, 1000=0.00288 (USD); Composition: Thick Film; Features: -; Size / Dimension: 0.039" L x 0.020" W (1.00mm x 0.50mm); Height: 0.016" (0.40mm); Number of Terminations: 2; Packaging: Cut Tape (CT); ComponentLink1URL: http://www.yageo.com/documents/recent/PYu-RC0402_51_RoHS_L_6.pdf; ComponentLink1Description: http://www.yageo.com/documents/recent/PYu-RC0402_51_RoHS_L_6.pdf
R48 R49 = RMCF0402FT4K99: RES TF 4.99K OHM 1% 1/16W 0402; Manufacturer: Stackpole Electronics Inc; Power (Watts): 0.063W, 1/16W; .Checked PCB: used; Temperature Coefficient: ±100ppm/°C; Category: Resistors; Supplier Part Number: RMCF0402FT4K99CT-ND; Manufacturer Part Number: RMCF0402FT4K99; Package / Case: 0402 (1005 Metric); Price 1k [$]: 0.00384; Resistance (Ohms): 4.99K; Tolerance: ±1%; Value: 4k99; .Checked SCH: used; Supplier: Digikey; Supplier 1: Digi-Key; Supplier Part Number 1: RMCF0402FT4K99CT-ND; RoHS: RoHS Compliant; Stock 1: 48509; Pricing 1: 1=0.04, 10=0.025, 50=0.0138, 100=0.0105, 250=0.0078, 500=0.00576, 1000=0.00384 (USD); Composition: Thick Film; Features: -; Size / Dimension: 0.039" L x 0.020" W (1.00mm x 0.50mm); Height: 0.016" (0.40mm); Number of Terminations: 2; Packaging: Cut Tape (CT); ComponentLink1URL: http://www.seielect.com/Catalog/SEI-RMCF.pdf; ComponentLink1Description: http://www.seielect.com/Catalog/SEI-RMCF.pdf
R50 = RC0402FR-0727KL: RES 27.0K OHM 1/16W 1% 0402 SMD; Manufacturer: Yageo; Power (Watts): 0.063W, 1/16W; .Checked PCB: RF; Temperature Coefficient: ±100ppm/°C; Category: Resistors; Supplier Part Number: 311-27.0KLRCT-ND; Manufacturer Part Number: RC0402FR-0727KL; Package / Case: 0402 (1005 Metric); Price 1k [$]: 0.00288; Resistance (Ohms): 27K; Tolerance: ±1%; Value: 27k; .Checked SCH: RF; Supplier: Digikey; Supplier 1: Digi-Key; Supplier Part Number 1: 311-27.0KLRCT-ND; RoHS: RoHS Compliant; Stock 1: 21638; Pricing 1: 10=0.014, 50=0.0104, 100=0.0079, 250=0.00584, 500=0.00432, 1000=0.00288 (USD); Composition: Thick Film; Features: -; Size / Dimension: 0.039" L x 0.020" W (1.00mm x 0.50mm); Height: 0.016" (0.40mm); Number of Terminations: 2; Packaging: Cut Tape (CT); ComponentLink1URL: http://www.yageo.com/documents/recent/PYu-RC0402_51_RoHS_L_6.pdf; ComponentLink1Description: http://www.yageo.com/documents/recent/PYu-RC0402_51_RoHS_L_6.pdf
U7 = CM2020-00TR: IC HDMI TX PORT P/I 38-TSSOP; Manufacturer: ON Semiconductor; .Creator: MM; .Checked PCB: RF, used by MM; Supplier 1: Digi-Key; Manufacturer Part Number: CM2020-00TR; RoHS: RoHS Compliant; Category: Integrated Circuits (ICs); Stock 1: 7580; Pricing 1: 1=1.52, 10=1.34, 25=1.2096, 100=1.0584, 250=0.9282, 500=0.8232, 1000=0.651 (USD); Packaging: Cut Tape (CT); Type: HDMI Transmitter; Applications: Consumer Electronics, DVD-RW Players, Set Top Box; Mounting Type: Surface Mount; Package / Case: 38-TFSOP (0.173", 4.40mm Width) Exposed Pad; Supplier Device Package: 38-TSSOP; ComponentLink1URL: http://www.onsemi.com/pub_link/Collateral/CM2020-00TR-D.PDF; ComponentLink1Description: http://www.onsemi.com/pub_link/Collateral/CM2020-00TR-D.PDF; Supplier Part Number 1: CM2020-00TROSCT-ND; .Checked SCH: RF, used by MM

## Sheet [15] - MISC, JTAG, HEADERS.SchDoc
size A3; DocumentNumber: 2; SheetNumber: 15; SheetTotal: 20
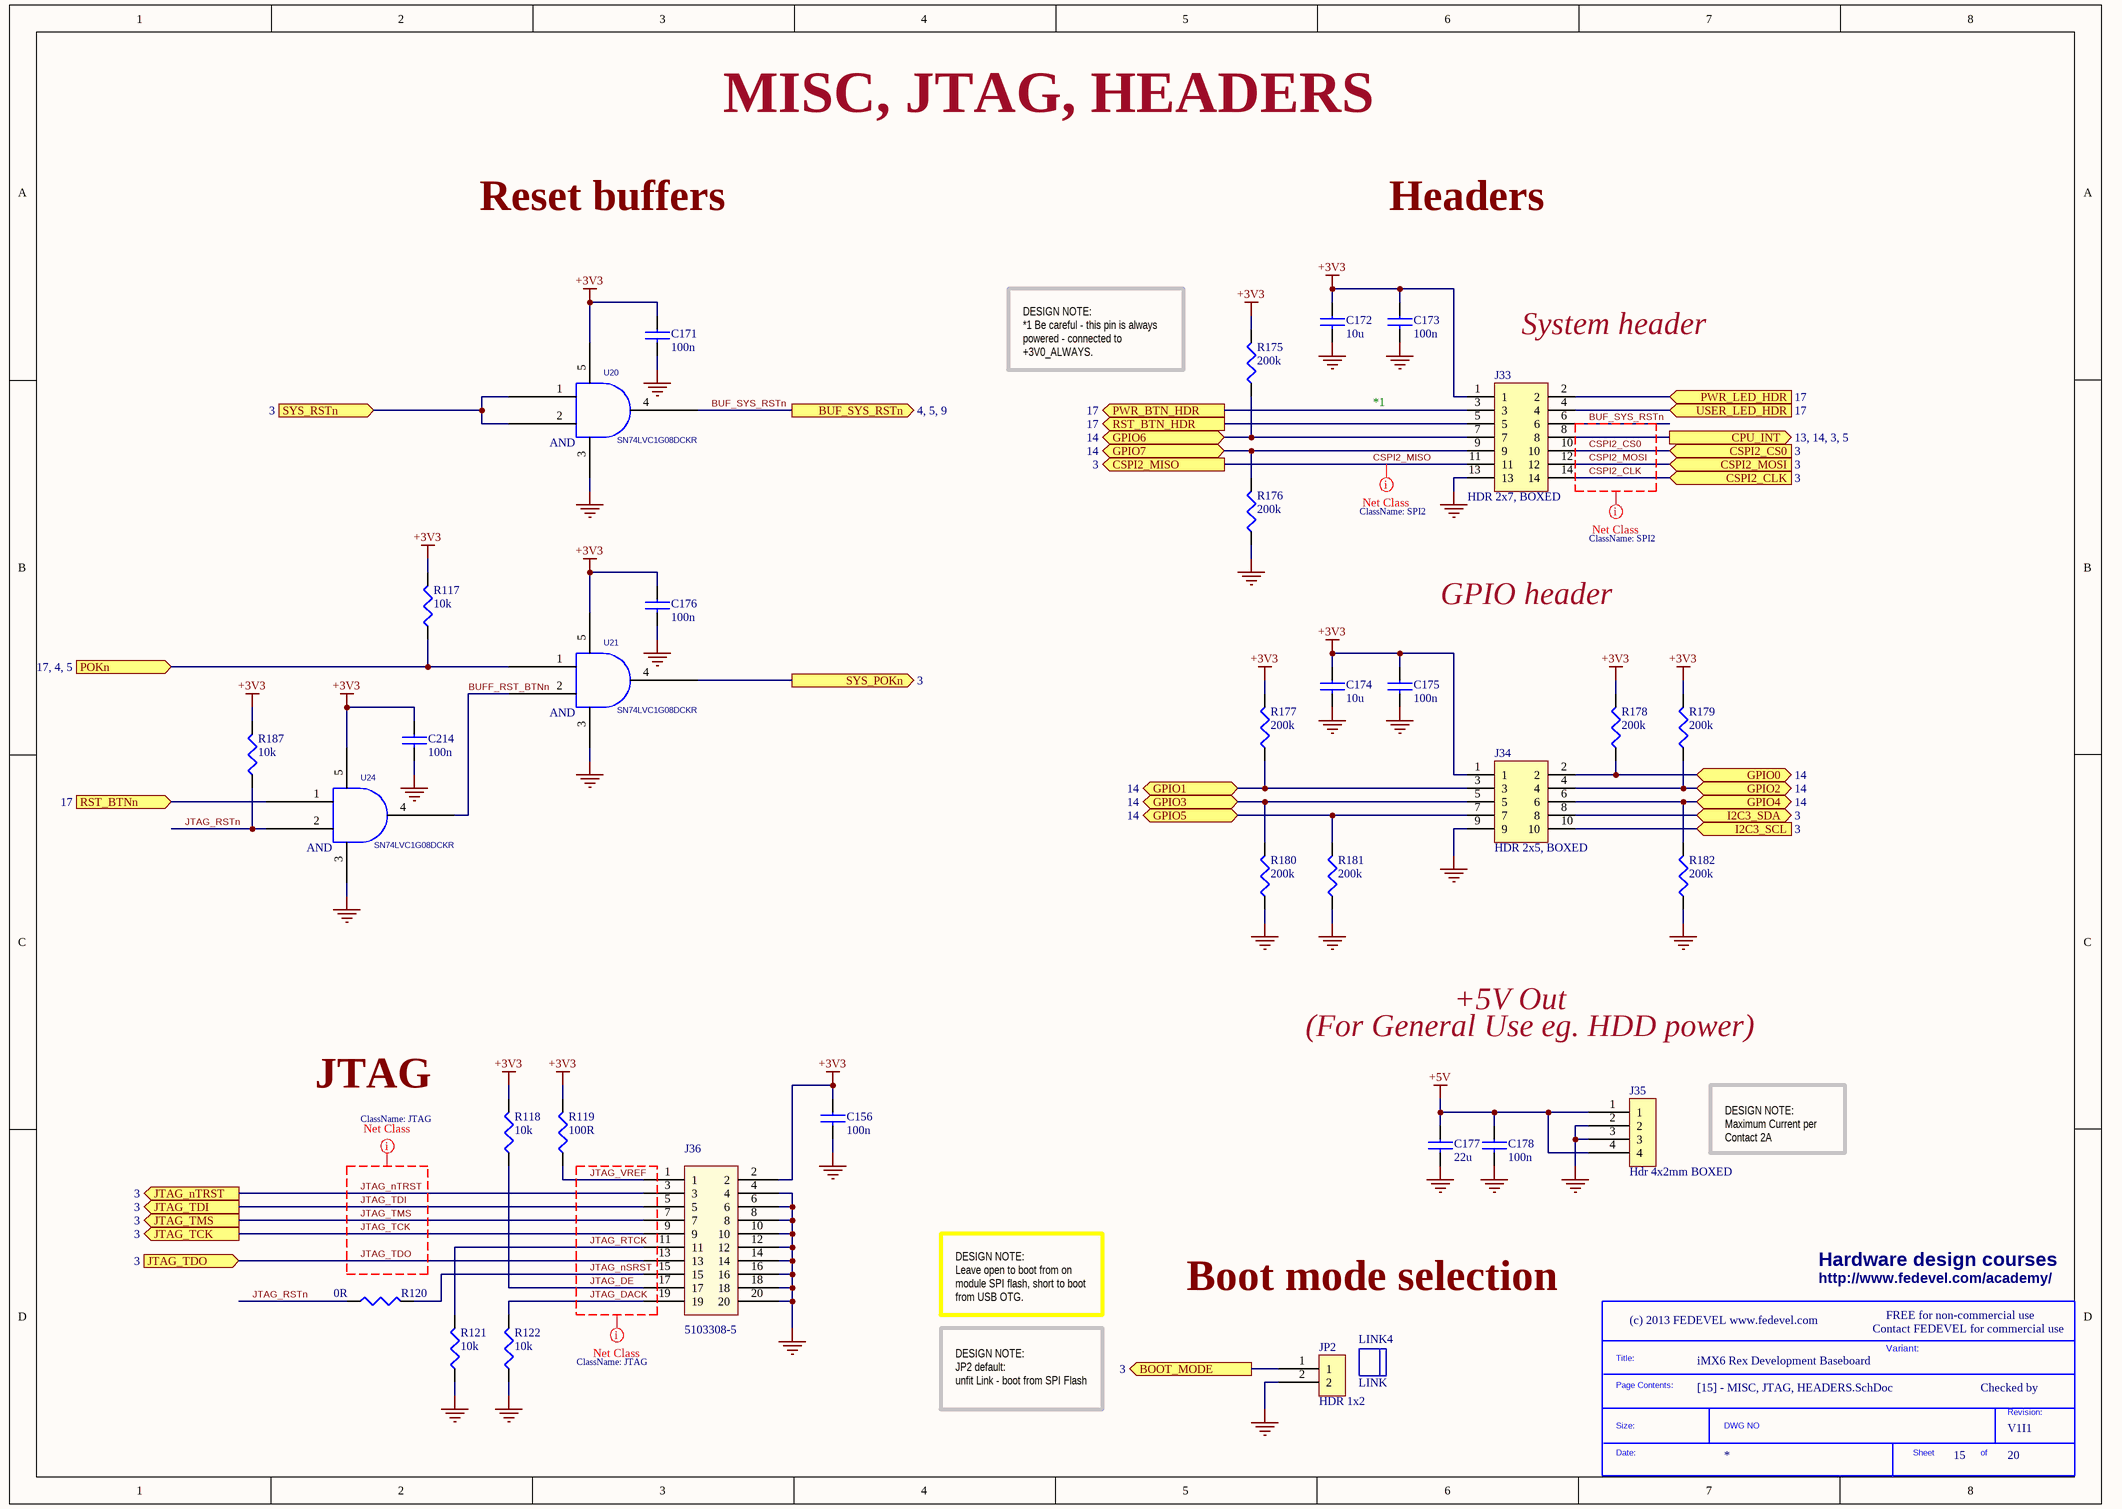
[diagram p3: [15] - MISC, JTAG, HEADERS.SchDoc]

### Parts
(Parts that share a designator on the sheet are numbered #1, #2 ... from top to bottom, then left to right.)
*#4  SDTitleBlock  (value not drawn)  (graphical)
C156  100n  [C0402]
C171  100n  [C0402]
C172  10u  [C0603]
C173  100n  [C0402]
C174  10u  [C0603]
C175  100n  [C0402]
C176  100n  [C0402]
C177  22u  [C0805]
C178  100n  [C0402]
C214  100n  [C0402]
J33  HDR 2x7, BOXED  [HDR_2x7_2.54MM_BOXED]
J34  HDR 2x5, BOXED  [HDR_2x5_2.54mm_BOXED]
J35  Hdr 4x2mm BOXED  [HDR_1x4_2MM_SHDR]
J36  5103308-5  [HDR_2x10_2.54mm_BOXED]
JP2  HDR 1x2  [HDR_1x2_2.54MM]
LINK4  LINK  (mechanical)
R117  10k  [R0402]
R118  10k  [R0402]
R119  100R  [R0402]
R120  0R  [R0402]
R121  10k  [R0402]
R122  10k  [R0402]
R175  200k  [R0402]
R176  200k  [R0402]
R177  200k  [R0402]
R178  200k  [R0402]
R179  200k  [R0402]
R180  200k  [R0402]
R181  200k  [R0402]
R182  200k  [R0402]
R187  10k  [R0402]
U20  SN74LVC1G08DCKR  [SC70_5]
U21  SN74LVC1G08DCKR  [SC70_5]
U24  SN74LVC1G08DCKR  [SC70_5]

### Ports
BOOT_MODE (out, see 3), BUF_SYS_RSTn (see 4, 5, 9), CPU_INT (out, see 13, 14, 3, 5), CSPI2_CLK (in, see 3), CSPI2_CS0 (in, see 3), CSPI2_MISO (out, see 3), CSPI2_MOSI (in, see 3), GPIO0 (bidir, see 14), GPIO1 (bidir, see 14), GPIO2 (bidir, see 14), GPIO3 (bidir, see 14), GPIO4 (bidir, see 14), GPIO5 (bidir, see 14), GPIO6 (bidir, see 14), GPIO7 (bidir, see 14), I2C3_SCL (in, see 3), I2C3_SDA (bidir, see 3), JTAG_nTRST (out, see 3), JTAG_TCK (out, see 3), JTAG_TDI (out, see 3), JTAG_TDO (in, see 3), JTAG_TMS (out, see 3), POKn (see 17, 4, 5), PWR_BTN_HDR (out, see 17), PWR_LED_HDR (in, see 17), RST_BTN_HDR (out, see 17), RST_BTNn (in, see 17), SYS_POKn (out, see 3), SYS_RSTn (in, see 3), USER_LED_HDR (in, see 17)

### Nets
+3V3: C156.1 C171.1 C172.1 C173.1 C174.1 C175.1 C176.1 C214.1 J33.1 J34.1 J36.2 R117.2 R118.2 R119.2 R175.2 R177.2 R178.2 R179.2 R187.2 U20.5(VCC) U21.5(VCC) U24.5(VCC)
+5V: C177.1 C178.1 J35.1 J35.4
GND: C156.2 C171.2 C172.2 C173.2 C174.2 C175.2 C176.2 C177.2 C178.2 C214.2 J33.13 J34.9 J35.2 J35.3 J36.4 J36.6 J36.8 J36.10 J36.12 J36.14 J36.16 J36.18 J36.20 JP2.2 R121.1 R122.1 R176.1 R180.1 R181.1 R182.1 U20.3(GND) U21.3(GND) U24.3(GND)
BOOT_MODE: JP2.1 ; port BOOT_MODE
BUF_SYS_RSTn: J33.6 U20.4(Y) ; port BUF_SYS_RSTn
BUFF_RST_BTNn: U21.2(B) U24.4(Y)
CPU_INT: J33.8 ; port CPU_INT
CSPI2_CLK: J33.14 ; port CSPI2_CLK
CSPI2_CS0: J33.10 ; port CSPI2_CS0
CSPI2_MISO: J33.11 ; port CSPI2_MISO
CSPI2_MOSI: J33.12 ; port CSPI2_MOSI
GPIO0: J34.2 R178.1 ; port GPIO0
GPIO1: J34.3 R177.1 ; port GPIO1
GPIO2: J34.4 R179.1 ; port GPIO2
GPIO3: J34.5 R180.2 ; port GPIO3
GPIO4: J34.6 R182.2 ; port GPIO4
GPIO5: J34.7 R181.2 ; port GPIO5
GPIO6: J33.7 R175.1 ; port GPIO6
GPIO7: J33.9 R176.2 ; port GPIO7
I2C3_SCL: J34.10 ; port I2C3_SCL
I2C3_SDA: J34.8 ; port I2C3_SDA
JTAG_DACK: J36.19 R122.2
JTAG_DE: J36.17 R118.1
JTAG_nSRST: J36.15 R120.2
JTAG_nTRST: J36.3 ; port JTAG_nTRST
JTAG_RSTn: R120.1 R187.1 U24.2(B)
JTAG_RTCK: J36.11 R121.2
JTAG_TCK: J36.9 ; port JTAG_TCK
JTAG_TDI: J36.5 ; port JTAG_TDI
JTAG_TDO: J36.13 ; port JTAG_TDO
JTAG_TMS: J36.7 ; port JTAG_TMS
JTAG_VREF: J36.1 R119.1
POKn: R117.1 U21.1(A) ; port POKn
PWR_BTN_HDR: J33.3 ; port PWR_BTN_HDR
PWR_LED_HDR: J33.2 ; port PWR_LED_HDR
RST_BTN_HDR: J33.5 ; port RST_BTN_HDR
RST_BTNn: U24.1(A) ; port RST_BTNn
SYS_POKn: U21.4(Y) ; port SYS_POKn
SYS_RSTn: U20.1(A) U20.2(B) ; port SYS_RSTn
USER_LED_HDR: J33.4 ; port USER_LED_HDR

### Layout directives
net class JTAG: JTAG_DACK, JTAG_DE, JTAG_nSRST, JTAG_nTRST, JTAG_RTCK, JTAG_TCK, JTAG_TDI, JTAG_TDO, JTAG_TMS, JTAG_VREF
net class SPI2: BUF_SYS_RSTn, CSPI2_CLK, CSPI2_CS0, CSPI2_MISO, CSPI2_MOSI

### Notes on the sheet
- MISC, JTAG, HEADERS
- Reset buffers
- Headers
- DESIGN NOTE:
  *1 Be careful - this pin is always powered - connected to +3V0_ALWAYS.
- System header
- *1
- GPIO header
- (For General Use eg. HDD power)
- +5V Out
- JTAG
- DESIGN NOTE:
  Maximum Current per Contact 2A
- Hardware design courses
- DESIGN NOTE:
  Leave open to boot from on module SPI flash, short to boot from USB OTG.
- (near *#4) Boot mode selection
- http://www.fedevel.com/academy/
- Contact FEDEVEL for commercial use
- FREE for non-commercial use
- Variant:
- Checked by
- DESIGN NOTE:
  JP2 default:
  unfit Link - boot from SPI Flash
- (in symbol SDTitleBlock) Title:; Page Contents:; Revision:; Size:; DWG NO; Date:; Sheet; of
- (in symbol SN74LVC1G08DCKR) AND

### Library data of the parts
C156 C171 C173 C175 C176 C178 C214 = C1005X5R1H104K: as C1 on sheet [03] - CONNECTORS; Category: Capacitors; Supplier Part Number: 445-5942-1-ND; Manufacturer Part Number: C1005X5R1H104K; Operating Temperature: -55°C ~ 85°C; Package / Case: 0402 (1005 Metric); Price 1k [$]: 0.02340; .Checked SCH: used; Voltage - Rated: 50V; Supplier: Digikey; Supplier 1: Digi-Key; Supplier Part Number 1: 445-5942-1-ND; RoHS: RoHS Compliant; Stock 1: 106926; Pricing 1: 1=0.27, 10=0.18, 100=0.072, 250=0.05176, 500=0.0369, 1000=0.027 (USD); Tolerance: ±10%; Temperature Coefficient: X5R; Mounting Type: Surface Mount, MLCC; Applications: General Purpose; Ratings: -; Size / Dimension: 0.039" L x 0.020" W (1.00mm x 0.50mm); Height - Seated (Max): -; Thickness (Max): 0.022" (0.55mm); Lead Spacing: -; Features: -; Packaging: Cut Tape (CT); Lead Style: -; ComponentLink1URL: http://www.tdk.co.jp/tefe02/e412_c.pdf; ComponentLink1Description: http://www.tdk.co.jp/tefe02/e412_c.pdf
C172 C174 = C1608X5R0J106M: CAP CER 10UF 6.3V X5R 20% 0603; Manufacturer: TDK Corporation; Capacitance: 10µF; Value: 10µF; .Checked PCB: used; Description: CAP CER 10UF 6.3V 20% X5R 0603; Category: Capacitors; Supplier Part Number: 445-4112-1-ND; Manufacturer Part Number: C1608X5R0J106M; Operating Temperature: -55°C ~ 85°C; Package / Case: 0603 (1608 Metric); Price 1k [$]: 0.08580; .Checked SCH: used; Voltage - Rated: 6.3V; Features: Low ESR; Supplier: Digikey; Supplier 1: Digi-Key; Supplier Part Number 1: 445-4112-1-ND; RoHS: RoHS Compliant; Stock 1: 48157; Pricing 1: 1=0.46, 10=0.363, 100=0.1898, 250=0.14024, 500=0.1089, 1000=0.0858 (USD); Tolerance: ±20%; Temperature Coefficient: X5R; Mounting Type: Surface Mount, MLCC; Applications: General Purpose; Ratings: -; Size / Dimension: 0.063" L x 0.031" W (1.60mm x 0.80mm); Height - Seated (Max): -; Thickness (Max): 0.037" (0.95mm); Lead Spacing: -; Packaging: Cut Tape (CT); Lead Style: -; ComponentLink1URL: http://www.tdk.com/pdf/general_B11.pdf; ComponentLink1Description: http://www.tdk.com/pdf/general_B11.pdf
C177 = C2012X5R1C226K: CAP CER 22UF 16V 10% X5R 0805; Manufacturer: TDK Corporation; Capacitance: 22µF; .Checked PCB: RF; Supplier 1: Digi-Key; Supplier Part Number 1: 445-6797-1-ND; Manufacturer Part Number: C2012X5R1C226K; RoHS: RoHS Compliant; Category: Capacitors; Stock 1: 15408; Pricing 1: 1=0.77, 10=0.737, 100=0.3575, 250=0.297, 500=0.2695, 1000=0.2475 (USD); Voltage - Rated: 16V; Tolerance: ±10%; Temperature Coefficient: X5R; Mounting Type: Surface Mount, MLCC; Operating Temperature: -55°C ~ 85°C; Applications: General Purpose; Ratings: -; Package / Case: 0805 (2012 Metric); Size / Dimension: 0.079" L x 0.049" W (2.00mm x 1.25mm); Height - Seated (Max): -; Thickness (Max): 0.057" (1.45mm); Lead Spacing: -; Features: -; Packaging: Cut Tape (CT); Lead Style: -; ComponentLink1URL: http://www.tdk.com/pdf/general_B11.pdf; ComponentLink1Description: http://www.tdk.com/pdf/general_B11.pdf; .Checked SCH: RF
J33 = D2514-6002-AR: CONN HEADER 14POS VERT 10GOLD; Manufacturer: 3M; Connector Type: Header, Shrouded; Number of Positions: 14; Number of Positions Loaded: All; Pitch: 0.100" (2.54mm); .Creator: MM; Supplier 1: Digi-Key; Manufacturer Part Number: D2514-6002-AR; RoHS: RoHS Compliant; Category: Connectors, Interconnects; Stock 1: 5967; Pricing 1: 1=1.62, 10=1.47, 50=1.32, 100=1.26, 250=1.14, 500=1.05, 1000=0.9, 2500=0.84, 5000=0.798 (USD); Packaging: Bulk; Contact Type: Male Pin; Number of Rows: 2; Row Spacing: 0.100" (2.54mm); Contact Mating Length: 0.243" (6.17mm); Mounting Type: Through Hole; Termination: Solder; Fastening Type: -; Features: -; Contact Finish: Gold; Contact Finish Thickness: 10µin (0.25µm); Color: Black; ComponentLink1URL: http://multimedia.3m.com/mws/mediawebserver?66666UuZjcFSLXTtm8T_oxMcEVuQEcuZgVs6EVs6E666666--; ComponentLink1Description: http://multimedia.3m.com/mws/mediawebserver?66666UuZjcFSLXTtm8T_oxMcEVuQEcuZgVs6EVs6E666666--; Supplier Part Number 1: MHC14E-ND; .Checked PCB: MM; .Checked SCH: MM
J34 = D2510-6002-AR: CONN HEADER 10POS VERT 10GOLD; Manufacturer: 3M; Connector Type: Header, Shrouded; Number of Positions: 10; Number of Positions Loaded: All; Pitch: 0.100" (2.54mm); .Creator: MM; Supplier 1: Digi-Key; Manufacturer Part Number: D2510-6002-AR; RoHS: RoHS Compliant; Category: Connectors, Interconnects; Stock 1: 1080; Pricing 1: 1=1.57, 10=1.421, 50=1.276, 100=1.218, 250=1.102, 500=1.015, 1000=0.87, 2500=0.812, 5000=0.7714 (USD); Packaging: Bulk; Contact Type: Male Pin; Number of Rows: 2; Row Spacing: 0.100" (2.54mm); Contact Mating Length: 0.243" (6.17mm); Mounting Type: Through Hole; Termination: Solder; Fastening Type: -; Features: -; Contact Finish: Gold; Contact Finish Thickness: 10µin (0.25µm); Color: Black; ComponentLink1URL: http://multimedia.3m.com/mws/mediawebserver?66666UuZjcFSLXTtm8T_oxMcEVuQEcuZgVs6EVs6E666666--; ComponentLink1Description: http://multimedia.3m.com/mws/mediawebserver?66666UuZjcFSLXTtm8T_oxMcEVuQEcuZgVs6EVs6E666666--; Supplier Part Number 1: MHC10E-ND; .Checked PCB: MM; .Checked SCH: MM
J35 = 0532530470: CONN HEADER 4POS 2MM VERT TIN; Manufacturer: Molex Inc; Connector Type: Header, Shrouded; Number of Positions: 4; Number of Positions Loaded: All; Pitch: 0.079" (2.00mm); .Creator: MM; Supplier 1: Digi-Key; Manufacturer Part Number: 0532530470; RoHS: RoHS Compliant; Category: Connectors, Interconnects; Stock 1: 5160; Pricing 1: 1=0.23, 10=0.211, 50=0.1576, 100=0.1464, 250=0.12948, 500=0.12386, 1000=0.10134, 2500=0.0929, 5000=0.09008 (USD); Packaging: Tray; Contact Type: Male Pin; Number of Rows: 1; Row Spacing: -; Contact Mating Length: 0.130" (3.30mm); Mounting Type: Through Hole; Termination: Press-Fit; Fastening Type: -; Features: -; Contact Finish: Tin; Contact Finish Thickness: -; Color: -; ComponentLink1URL: http://www.molex.com/pdm_docs/sd/532530270_sd.pdf; ComponentLink1Description: http://www.molex.com/pdm_docs/sd/532530270_sd.pdf; Supplier Part Number 1: WM19006-ND; .Checked PCB: MM; .Checked SCH: MM
J36 = 5103308-5: CONN HEADER LOPRO STR 20POS GOLD; Manufacturer: TE Connectivity; Connector Type: Header, Shrouded; Number of Positions: 20; Number of Positions Loaded: All; Pitch: 0.100" (2.54mm); .Creator: MM; Supplier 1: Digi-Key; Manufacturer Part Number: 5103308-5; RoHS: RoHS Compliant; Category: Connectors, Interconnects; Stock 1: 3482; Pricing 1: 1=1.9, 25=1.6212, 50=1.5508, 100=1.4803, 250=1.33928, 500=1.23356, 1000=1.05734, 2500=0.98685, 5000=0.9375 (USD); Packaging: Tube; Contact Type: Male Pin; Number of Rows: 2; Row Spacing: 0.100" (2.54mm); Contact Mating Length: 0.240" (6.10mm); Mounting Type: Through Hole; Termination: Solder; Fastening Type: -; Features: -; Contact Finish: Gold or Gold-Palladium; Contact Finish Thickness: 15µin (0.38µm); Color: Black; ComponentLink1URL: http://www.te.com/commerce/DocumentDelivery/DDEController?Action=srchrtrv&DocNm=5103308&DocType=Customer+Drawing&DocLang=English; ComponentLink1Description: http://www.te.com/commerce/DocumentDelivery/DDEController?Action=srchrtrv&DocNm=5103308&DocType=Customer+Drawing&DocLang=English; Supplier Part Number 1: A33165-ND; .Checked PCB: MM; .Checked SCH: MM
JP2 = 68001-202HLF: BERGSTIK II .100" SR STRAIGHT; Manufacturer: FCI; Connector Type: Header, Unshrouded; Number of Positions: 2; Number of Positions Loaded: All; Pitch: 0.100" (2.54mm); .Checked PCB: RF; Supplier 1: Digi-Key; Supplier Part Number 1: 609-3469-ND; Manufacturer Part Number: 68001-202HLF; RoHS: RoHS Compliant; Category: Connectors, Interconnects; Stock 1: 13680; Pricing 1: 1=0.45, 10=0.265, 100=0.1172, 250=0.09828, 500=0.09072, 1000=0.07938, 5000=0.05065 (USD); Contact Type: Male Pin; Number of Rows: 1; Row Spacing: -; Contact Mating Length: 0.230" (5.84mm); Mounting Type: Through Hole; Termination: Solder; Fastening Type: -; Features: -; Contact Finish: Gold; Contact Finish Thickness: 15µin (0.38µm); Color: Black; Packaging: Bulk; ComponentLink1URL: http://portal.fciconnect.com/res/en/pdffiles/doc_search/68000.pdf; ComponentLink1Description: http://portal.fciconnect.com/res/en/pdffiles/doc_search/68000.pdf; .Checked SCH: RF
LINK4 = QPC02SXGN-RC: CONN JUMPER SHORTING .100" GOLD; Manufacturer: Sullins Connector Solutions; Gender: Female Sockets; Number of Positions or Pins (Grid): 2 (1 x 2); Pitch: 0.100" (2.54mm); .Checked SCH: RF; Supplier 1: Digi-Key; Supplier Part Number 1: S9337-ND; Manufacturer Part Number: QPC02SXGN-RC; RoHS: RoHS Compliant; Category: Connectors, Interconnects; Stock 1: 23274; Pricing 1: 1=0.11, 10=0.066, 25=0.0468, 50=0.0384, 100=0.033, 250=0.02792, 500=0.0258, 1000=0.0228, 2500=0.018 (USD); Type: Open Top; Height: 0.235" (5.97mm); Contact Finish: Gold; Contact Finish Thickness: Flash; Color: -; Packaging: Bulk; ComponentLink1URL: http://www.sullinscorp.com/drawings/284_SXGN_11510.pdf; ComponentLink1Description: http://www.sullinscorp.com/drawings/284_SXGN_11510.pdf
R117 R118 R121 R122 R187 = RC0402FR-0710KL: RES 10.0K OHM 1/16W 1% 0402 SMD; Manufacturer: Yageo; Power (Watts): 0.063W, 1/16W; .Checked PCB: used; Temperature Coefficient: ±100ppm/°C; Category: Resistors; Supplier Part Number: 311-10.0KLRCT-ND; Manufacturer Part Number: RC0402FR-0710KL; Package / Case: 0402 (1005 Metric); Price 1k [$]: 0.01421; Resistance (Ohms): 10K; Tolerance: ±1%; Value: 10k; .Checked SCH: used; Supplier: Digikey; Supplier 1: Digi-Key; Supplier Part Number 1: 311-10.0KLRCT-ND; RoHS: RoHS Compliant; Stock 1: 2916495; Pricing 1: 10=0.014, 50=0.0104, 100=0.0079, 250=0.00584, 500=0.00432, 1000=0.00288 (USD); Composition: Thick Film; Features: -; Size / Dimension: 0.039" L x 0.020" W (1.00mm x 0.50mm); Height: 0.016" (0.40mm); Number of Terminations: 2; Packaging: Cut Tape (CT); ComponentLink1URL: http://www.yageo.com/documents/recent/PYu-RC0402_51_RoHS_L_6.pdf; ComponentLink1Description: http://www.yageo.com/documents/recent/PYu-RC0402_51_RoHS_L_6.pdf
R119 = RC0402FR-07100RL: RES 100 OHM 1/16W 1% 0402 SMD; Manufacturer: Yageo; Resistance (Ohms): 100; Power (Watts): 0.063W, 1/16W; .Checked PCB: RF; Temperature Coefficient: ±100ppm/°C; Category: Resistors; Supplier Part Number: 311-100LRCT-ND; Manufacturer Part Number: RC0402FR-07100RL; Package / Case: 0402 (1005 Metric); Price 1k [$]: 0.01421; Tolerance: ±1%; Value: 100R; .Checked SCH: RF; Supplier: Digikey; Supplier 1: Digi-Key; Supplier Part Number 1: 311-100LRCT-ND; RoHS: RoHS Compliant; Stock 1: 1682040; Pricing 1: 10=0.014, 50=0.0104, 100=0.0079, 250=0.00584, 500=0.00432, 1000=0.00288 (USD); Composition: Thick Film; Features: -; Size / Dimension: 0.039" L x 0.020" W (1.00mm x 0.50mm); Height: 0.016" (0.40mm); Number of Terminations: 2; Packaging: Cut Tape (CT); ComponentLink1URL: http://www.yageo.com/documents/recent/PYu-RC0402_51_RoHS_L_6.pdf; ComponentLink1Description: http://www.yageo.com/documents/recent/PYu-RC0402_51_RoHS_L_6.pdf
R120 = RC0402JR-070RL: as R159 on sheet [03] - CONNECTORS; Category: Resistors; Supplier Part Number: 311-0.0JRCT-ND; Manufacturer Part Number: RC0402JR-070RL; Package / Case: 0402 (1005 Metric); Price 1k [$]: 0.01389; Value: 0R; .Checked SCH: used; Supplier: Digikey; Supplier 1: Digi-Key; Supplier Part Number 1: 311-0.0JRCT-ND; RoHS: RoHS Compliant; Stock 1: 1106330; Pricing 1: 10=0.012, 50=0.009, 100=0.0069, 250=0.00512, 500=0.0038, 1000=0.00253 (USD); Composition: Thick Film; Features: -; Temperature Coefficient: -; Size / Dimension: 0.039" L x 0.020" W (1.00mm x 0.50mm); Height: 0.016" (0.40mm); Number of Terminations: 2; Packaging: Cut Tape (CT); ComponentLink1URL: http://www.yageo.com/documents/recent/PYu-RC0402_51_RoHS_L_6.pdf; ComponentLink1Description: http://www.yageo.com/documents/recent/PYu-RC0402_51_RoHS_L_6.pdf
R175-R182 = RC0402FR-07200KL: RES 200K OHM 1/16W 1% 0402 SMD; Manufacturer: Yageo; Power (Watts): 0.063W, 1/16W; .Checked PCB: used; Temperature Coefficient: ±100ppm/°C; Category: Resistors; Supplier Part Number: 311-200KLRCT-ND; Manufacturer Part Number: RC0402FR-07200KL; Package / Case: 0402 (1005 Metric); Price 1k [$]: 0.01421; Resistance (Ohms): 200K; Tolerance: ±1%; Value: 200k; .Checked SCH: used; Supplier: Digikey; Supplier 1: Digi-Key; Supplier Part Number 1: 311-200KLRCT-ND; RoHS: RoHS Compliant; Stock 1: 225869; Pricing 1: 10=0.014, 50=0.0104, 100=0.0079, 250=0.00584, 500=0.00432, 1000=0.00288 (USD); Composition: Thick Film; Features: -; Size / Dimension: 0.039" L x 0.020" W (1.00mm x 0.50mm); Height: 0.016" (0.40mm); Number of Terminations: 2; Packaging: Cut Tape (CT); ComponentLink1URL: http://www.yageo.com/documents/recent/PYu-RC0402_51_RoHS_L_6.pdf; ComponentLink1Description: http://www.yageo.com/documents/recent/PYu-RC0402_51_RoHS_L_6.pdf
U20 U21 U24 = SN74LVC1G08DCKR: SINGLE POSITIVE AND GATE SC-70; Manufacturer: Texas Instruments; .Checked PCB: used; Number of Inputs: 2; Voltage - Supply: 1.65 V ~ 5.5 V; Number of Circuits: 1; Current - Output High, Low: 32mA, 32mA; .Checked SCH: used; Category: Integrated Circuits (ICs); Supplier Part Number: 296-11602-1-ND; Family: Logic - Gates and Inverters; Manufacturer Part Number: SN74LVC1G08DCKR; Operating Temperature: -40°C ~ 85°C; Package / Case: 6-TSSOP (5 lead), SC-88A, SOT-353; Price 1k [$]: 0.11250; Value: SN74LVC1G08DCKR; Logic Type: AND Gate; Supplier: Digikey; Supplier 1: Digi-Key; Supplier Part Number 1: 296-11602-1-ND; RoHS: RoHS Compliant; Stock 1: 36212; Pricing 1: 1=0.7, 25=0.322, 100=0.224, 250=0.1596, 500=0.1218, 1000=0.084 (USD); Mounting Type: Surface Mount; Supplier Device Package: SC-70-5; Packaging: Cut Tape (CT); ComponentLink1URL: http://www.ti.com/lit/ds/symlink/sn74lvc1g08.pdf; ComponentLink1Description: http://www.ti.com/lit/ds/symlink/sn74lvc1g08.pdf

## Sheet [18] - DOC, POWER SEQUENCING.SchDoc
size A3; DocumentNumber: 2; SheetNumber: 18; SheetTotal: 20
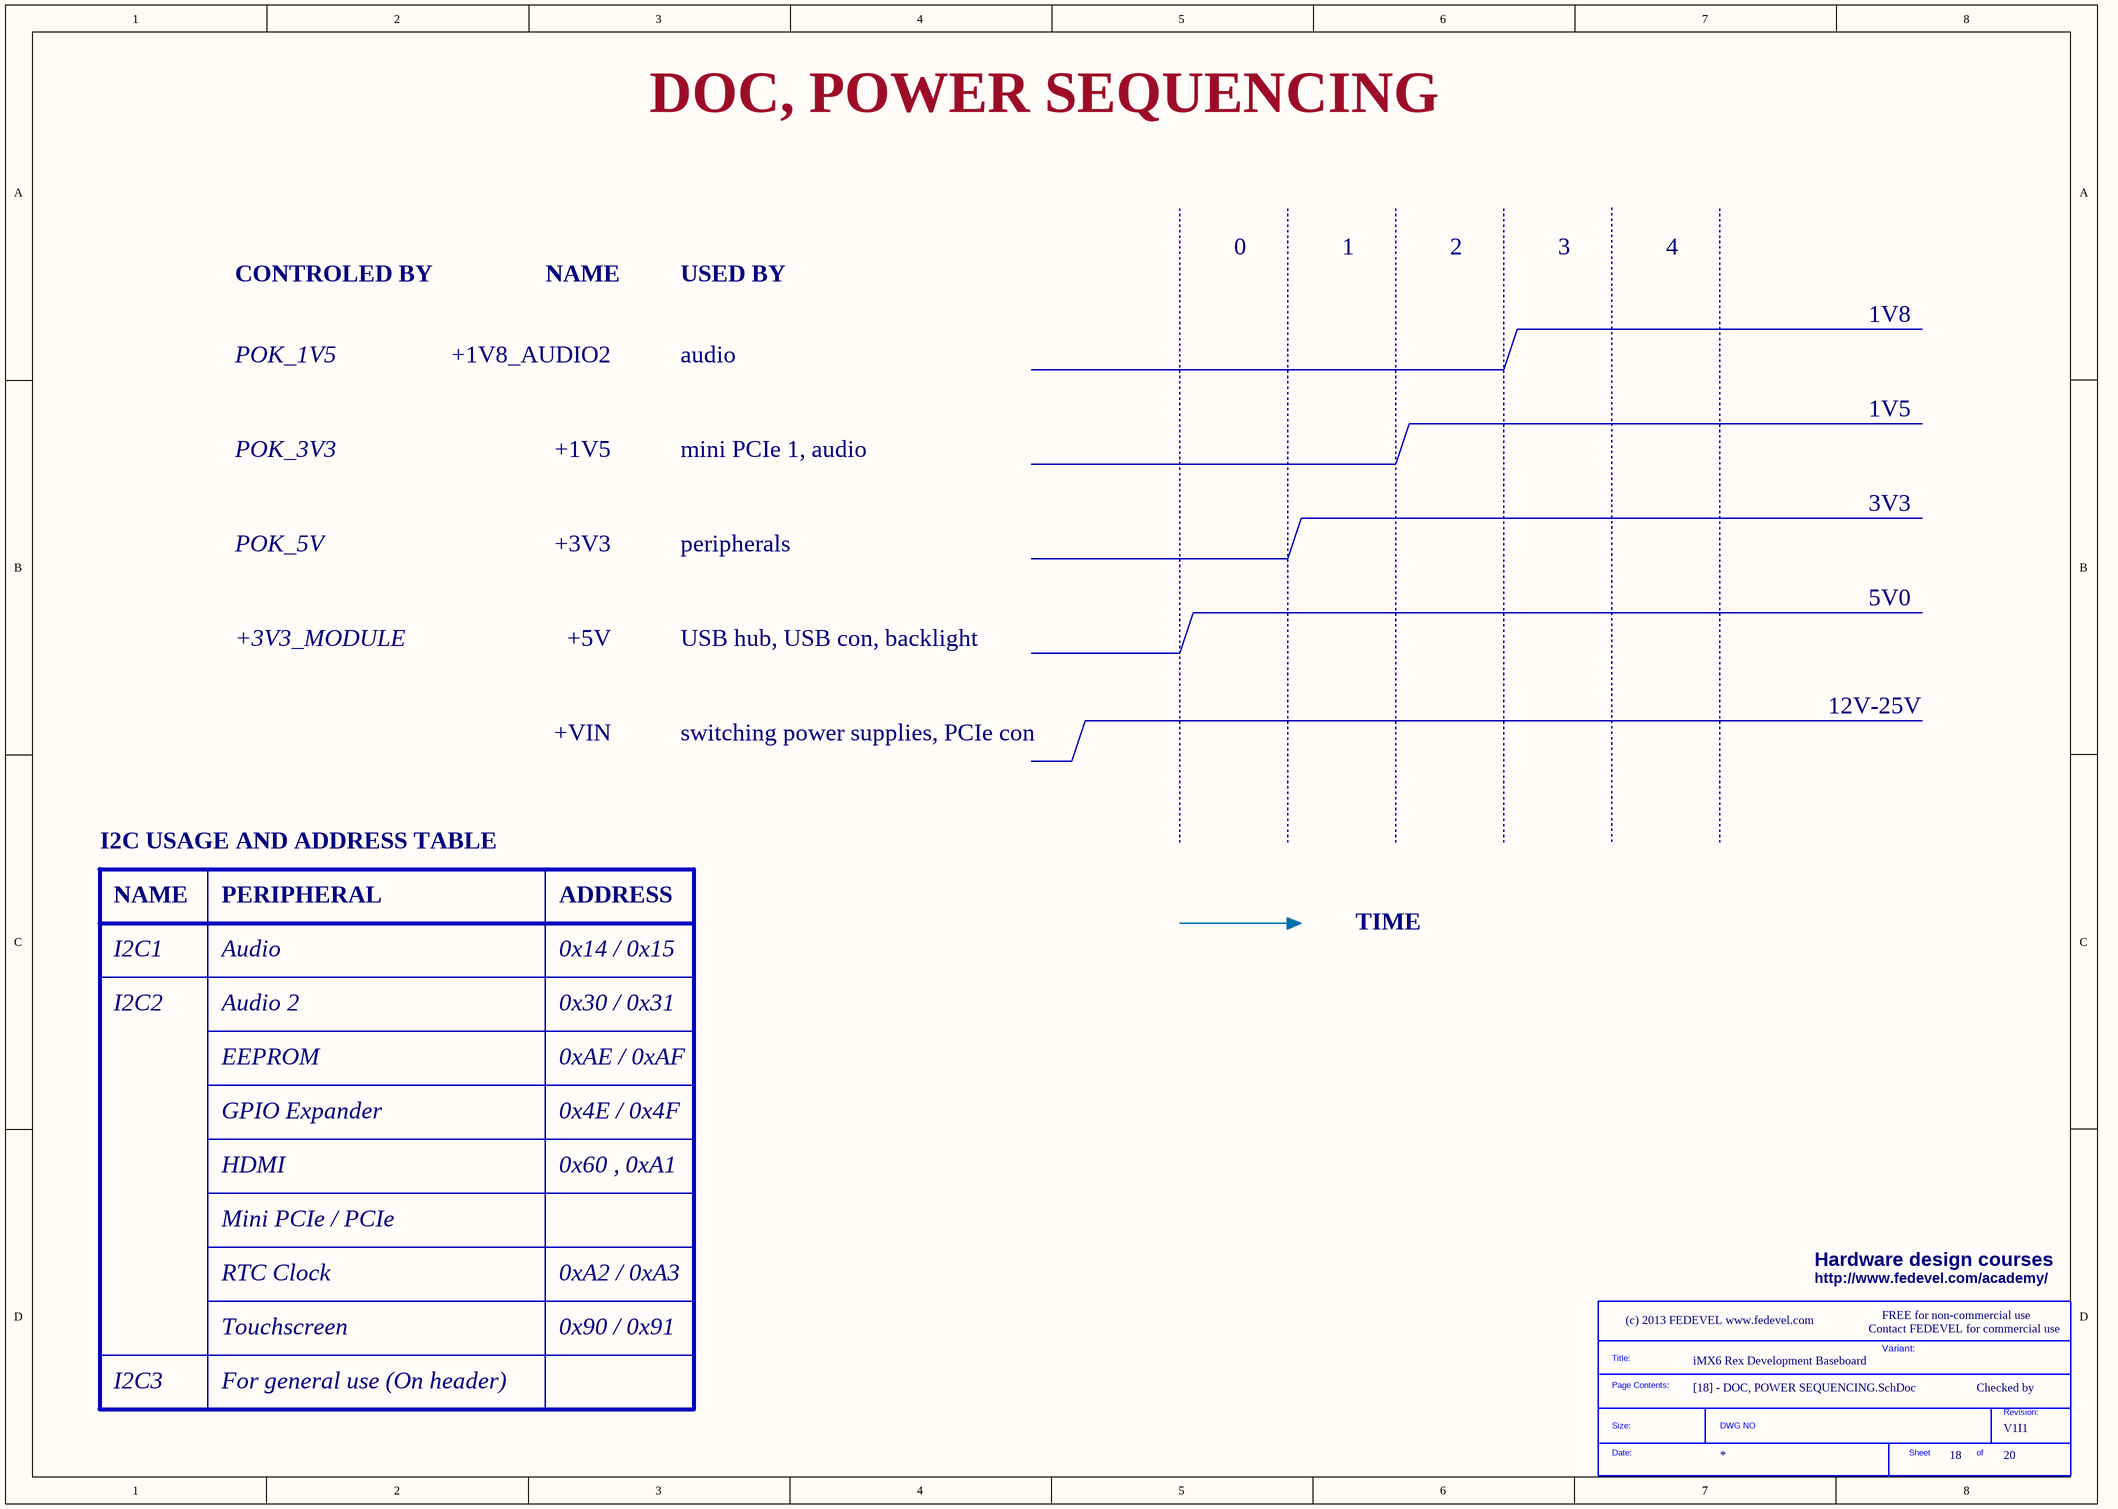
[diagram p4: [18] - DOC, POWER SEQUENCING.SchDoc]

### Parts
(Parts that share a designator on the sheet are numbered #1, #2 ... from top to bottom, then left to right.)
*#5  SDTitleBlock  (value not drawn)  (graphical)

### Notes on the sheet
- DOC, POWER SEQUENCING
- CONTROLED BY
- NAME
- USED BY
- 0
- 1
- 2
- 3
- 4
- POK_1V5
- +1V8_AUDIO2
- audio
- 1V8
- 1V5
- POK_3V3
- +1V5
- mini PCIe 1, audio
- 3V3
- POK_5V
- +3V3
- peripherals
- +3V3_MODULE
- +5V
- USB hub, USB con, backlight
- 5V0
- 12V-25V
- +VIN
- switching power supplies, PCIe con
- I2C USAGE AND ADDRESS TABLE
- PERIPHERAL
- ADDRESS
- I2C1
- Audio
- 0x14 / 0x15
- TIME
- I2C2
- Audio 2
- 0x30 / 0x31
- EEPROM
- GPIO Expander
- 0xAE / 0xAF
- 0x4E / 0x4F
- HDMI
- 0x60 , 0xA1
- Mini PCIe / PCIe
- Hardware design courses
- RTC Clock
- 0xA2 / 0xA3
- http://www.fedevel.com/academy/
- Contact FEDEVEL for commercial use
- FREE for non-commercial use
- I2C3
- For general use (On header)
- Touchscreen
- 0x90 / 0x91
- Variant:
- Checked by
- (in symbol SDTitleBlock) Title:; Page Contents:; Revision:; Size:; DWG NO; Date:; Sheet; of